# EAGLE design Calliope mini rev0.3.3_gipfel (EAGLE 6.6.0)
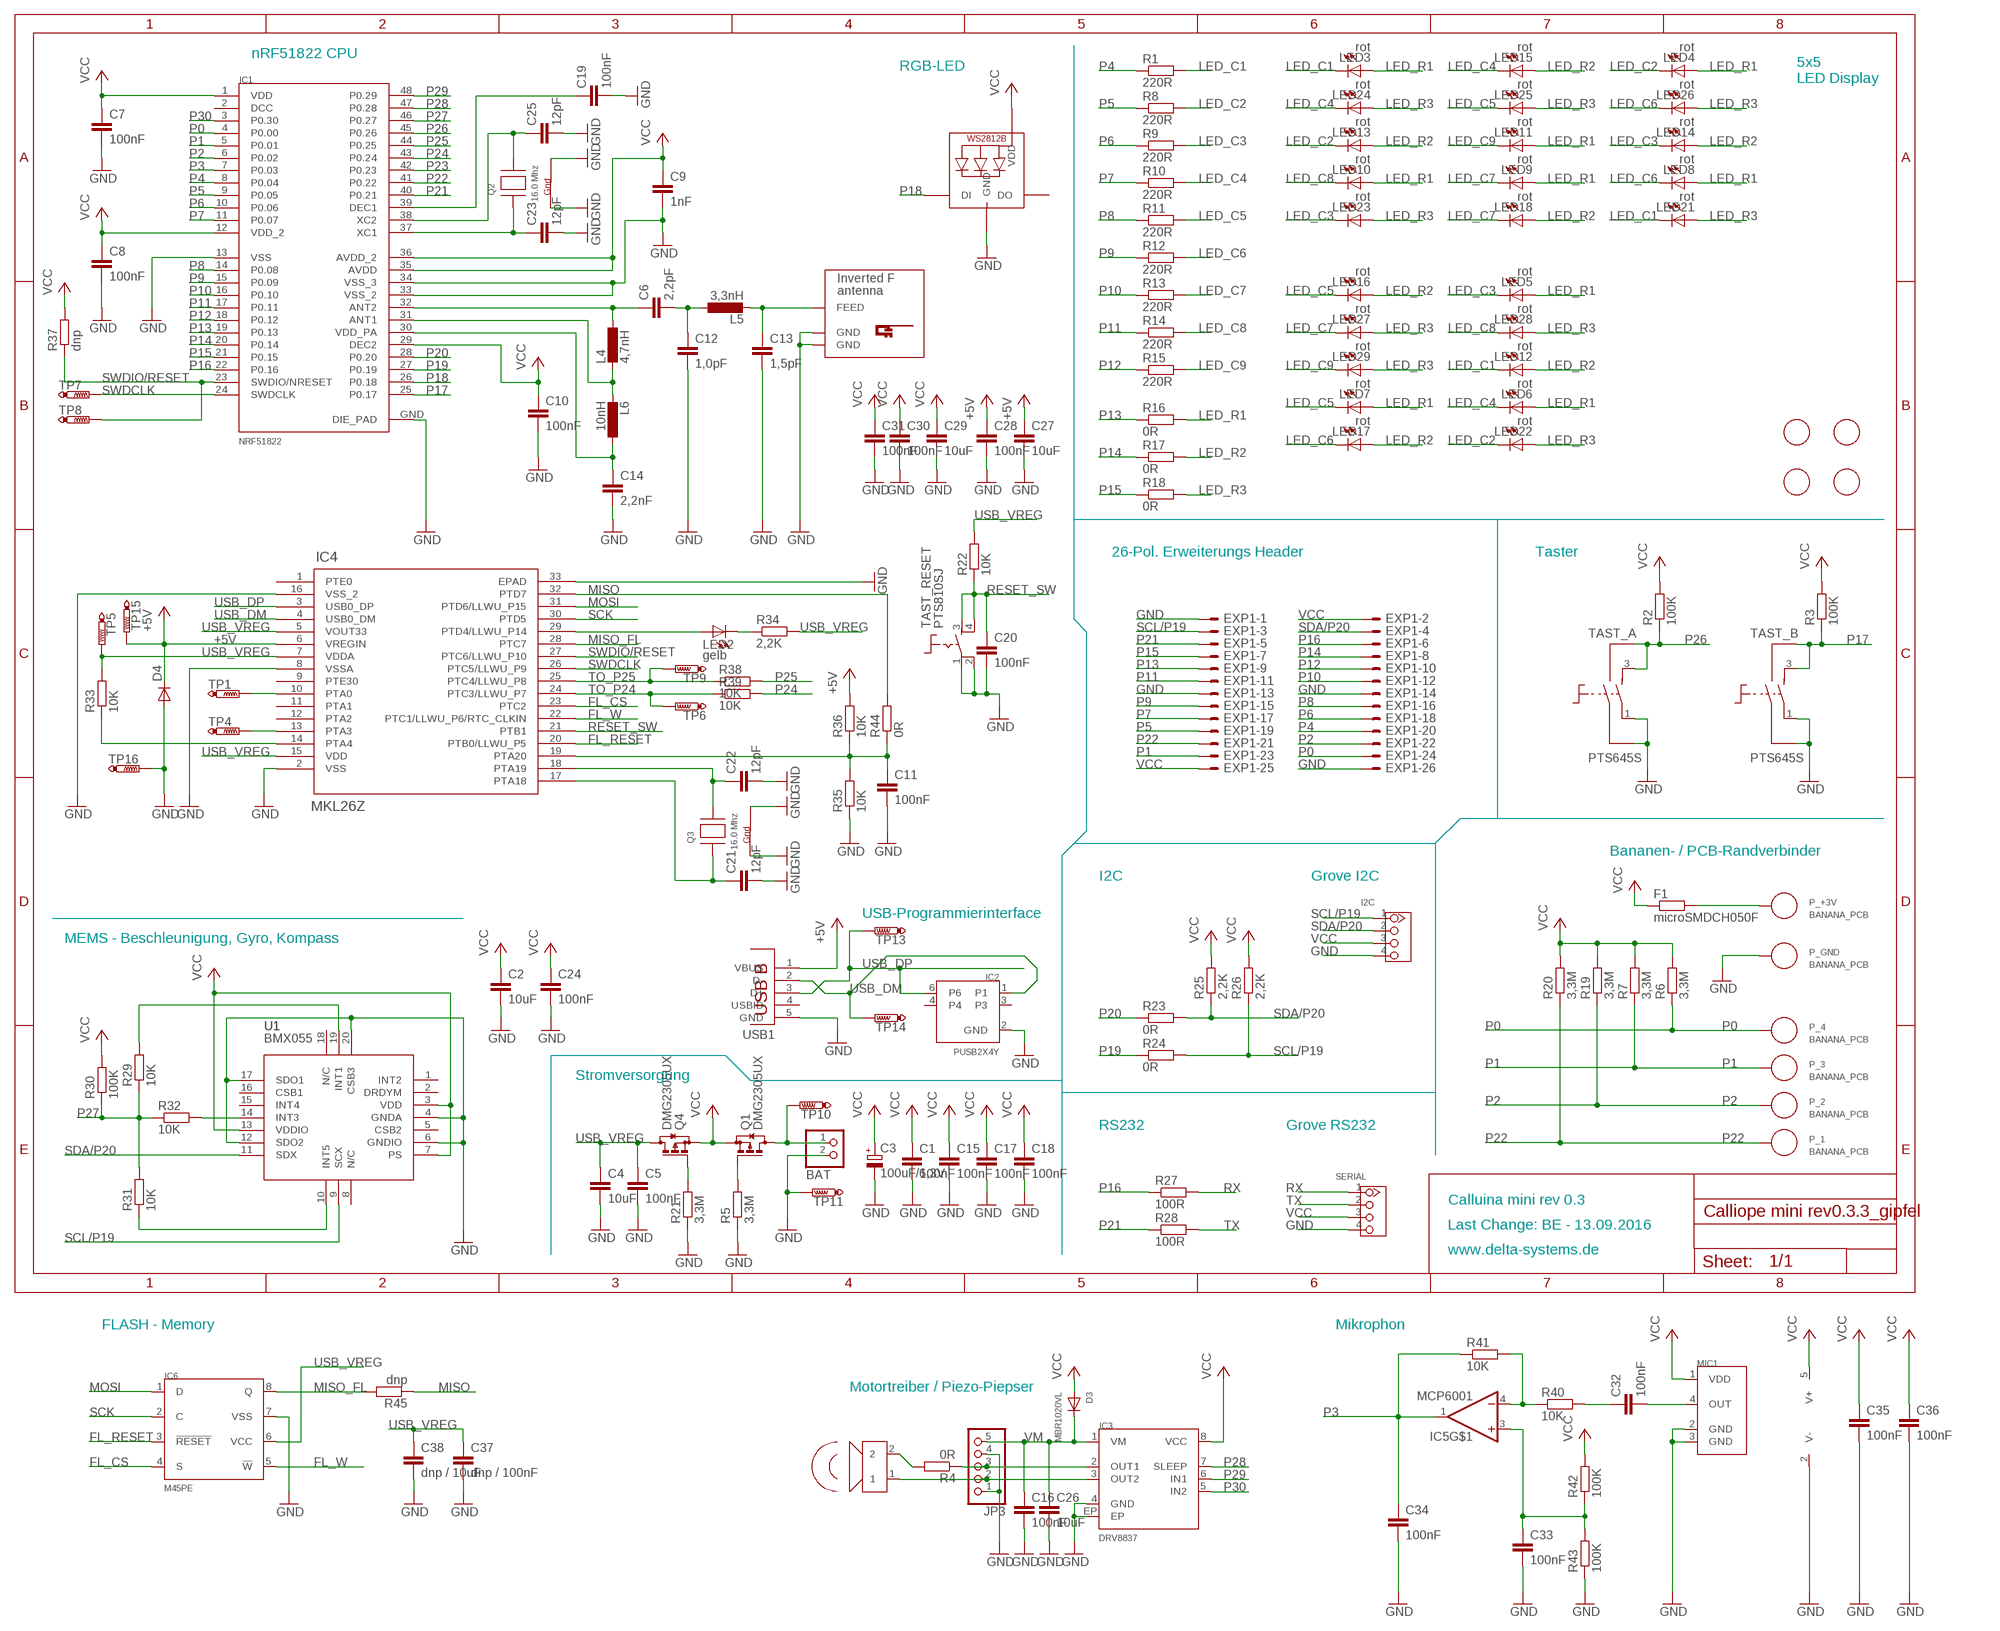
[diagram p0: schematic, sheet 1]

## Parts
BAT  JST_2PIN-SMT-RA  [JST-PH-2-SMT-RA]
C1  100nF  C-EU0402  [0402]
C2  10uF  C-EU0603  [0603]
C3  100uF/6,3V  CPOL-EUD/7343-31R  [D/7343-31R]
C4  10uF  C-EU0603  [0603]
C5  100nF  C-EU0402  [0402]
C6  2,2pF  C-EU0402  [0402]
C7  100nF  C-EU0402  [0402]
C8  100nF  C-EU0402  [0402]
C9  1nF  C-EU0402  [0402]
C10  100nF  C-EU0402  [0402]
C11  100nF  C-EU0402  [0402]
C12  1,0pF  C-EU0402  [0402]
C13  1,5pF  C-EU0402  [0402]
C14  2,2nF  C-EU0402  [0402]
C15  100nF  C-EU0402  [0402]
C16  100nF  C-EU0402  [0402]
C17  100nF  C-EU0402  [0402]
C18  100nF  C-EU0402  [0402]
C19  100nF  C-EU0402  [0402]
C20  100nF  C-EU0402  [0402]
C21  12pF  C-EU0402  [0402]
C22  12pF  C-EU0402  [0402]
C23  12pF  C-EU0402  [0402]
C24  100nF  C-EU0402  [0402]
C25  12pF  C-EU0402  [0402]
C26  10uF  C-EU0603  [0603]
C27  10uF  C-EU0603  [0603]
C28  100nF  C-EU0402  [0402]
C29  10uF  C-EU0603  [0603]
C30  100nF  C-EU0402  [0402]
C31  100nF  C-EU0402  [0402]
C32  100nF  C-EU0402  [0402]
C33  100nF  C-EU0402  [0402]
C34  100nF  C-EU0402  [0402]
C35  100nF  C-EU0402  [0402]
C36  100nF  C-EU0402  [0402]
C37  dnp / 100nF  C-EU0402  [0402]
C38  dnp / 10uF  C-EU0603  [0603]
D3  MBR1020VL  DIODE_SOD-123FL  [SOD-123FL]
D4  DIODE-SOD323-R  [SOD323-R]
EXP1  ML26E  [ML26]
F1  microSMDCH050F  R-EU_R1210  [R1210]
I2C  GROVE-CONNECTOR-DIP(4P-2.0)  [HW4-2.0]
IC1  NRF51822  [QFN48]
IC2  PUSB2X4Y  [SOT363]
IC3  DRV8837  [WSON8]
IC4  MKL26Z  [QFN_32_5X5X0P9]
IC5  MCP6001  OPAMP_SINGLESOT23-5  [SOT23-5]
IC6  M45PE  [VQFN8_6X5]
JP3  PINHD-1X5  [1X05]
L4  4,7nH  L-EU0402  [0402]
L5  3,3nH  L-EU0402  [0402]
L6  10nH  L-EU0402  [0402]
LED1  SK6812MINI  WS2812B3535  [LED3535]
LED2  gelb  LEDCHIPLED_0603  [CHIPLED_0603]
LED3  rot  LEDCHIPLED_0603  [CHIPLED_0603]
LED4  rot  LEDCHIPLED_0603  [CHIPLED_0603]
LED5  rot  LEDCHIPLED_0603  [CHIPLED_0603]
LED6  rot  LEDCHIPLED_0603  [CHIPLED_0603]
LED7  rot  LEDCHIPLED_0603  [CHIPLED_0603]
LED8  rot  LEDCHIPLED_0603  [CHIPLED_0603]
LED9  rot  LEDCHIPLED_0603  [CHIPLED_0603]
LED10  rot  LEDCHIPLED_0603  [CHIPLED_0603]
LED11  rot  LEDCHIPLED_0603  [CHIPLED_0603]
LED12  rot  LEDCHIPLED_0603  [CHIPLED_0603]
LED13  rot  LEDCHIPLED_0603  [CHIPLED_0603]
LED14  rot  LEDCHIPLED_0603  [CHIPLED_0603]
LED15  rot  LEDCHIPLED_0603  [CHIPLED_0603]
LED16  rot  LEDCHIPLED_0603  [CHIPLED_0603]
LED17  rot  LEDCHIPLED_0603  [CHIPLED_0603]
LED18  rot  LEDCHIPLED_0603  [CHIPLED_0603]
LED21  rot  LEDCHIPLED_0603  [CHIPLED_0603]
LED22  rot  LEDCHIPLED_0603  [CHIPLED_0603]
LED23  rot  LEDCHIPLED_0603  [CHIPLED_0603]
LED24  rot  LEDCHIPLED_0603  [CHIPLED_0603]
LED25  rot  LEDCHIPLED_0603  [CHIPLED_0603]
LED26  rot  LEDCHIPLED_0603  [CHIPLED_0603]
LED27  rot  LEDCHIPLED_0603  [CHIPLED_0603]
LED28  rot  LEDCHIPLED_0603  [CHIPLED_0603]
LED29  rot  LEDCHIPLED_0603  [CHIPLED_0603]
MIC1  SPU0410HR5H-PB  [SPU0410HR5H-PB]
P_1  BANANA_PCB  [BANANA_REC]
P_2  BANANA_PCB  [BANANA_REC]
P_3  BANANA_PCB  [BANANA_REC]
P_4  BANANA_PCB  [BANANA_REC]
P_+3V  BANANA_PCB  [BANANA_REC]
P_GND  BANANA_PCB  [BANANA_REC]
Q1  DMG2305UX  BSS84  [SOT23]
Q2  16.0 Mhz  XTAL-4-3225  [NX3225]
Q3  16.0 Mhz  XTAL-4-3225  [NX3225]
Q4  DMG2305UX  BSS84  [SOT23]
R1  220R  R-EU_0402  [0402]
R2  100K  R-EU_0402  [0402]
R3  100K  R-EU_0402  [0402]
R4  0R  R-EU_0402  [0402]
R5  3,3M  R-EU_0402  [0402]
R6  3,3M  R-EU_0402  [0402]
R7  3,3M  R-EU_0402  [0402]
R8  220R  R-EU_0402  [0402]
R9  220R  R-EU_0402  [0402]
R10  220R  R-EU_0402  [0402]
R11  220R  R-EU_0402  [0402]
R12  220R  R-EU_0402  [0402]
R13  220R  R-EU_0402  [0402]
R14  220R  R-EU_0402  [0402]
R15  220R  R-EU_0402  [0402]
R16  0R  R-EU_0402  [0402]
R17  0R  R-EU_0402  [0402]
R18  0R  R-EU_0402  [0402]
R19  3,3M  R-EU_0402  [0402]
R20  3,3M  R-EU_0402  [0402]
R21  3,3M  R-EU_0402  [0402]
R22  10K  R-EU_0402  [0402]
R23  0R  R-EU_0402  [0402]
R24  0R  R-EU_0402  [0402]
R25  2,2K  R-EU_0402  [0402]
R26  2,2K  R-EU_0402  [0402]
R27  100R  R-EU_0402  [0402]
R28  100R  R-EU_0402  [0402]
R29  10K  R-EU_0402  [0402]
R30  100K  R-EU_0402  [0402]
R31  10K  R-EU_0402  [0402]
R32  10K  R-EU_0402  [0402]
R33  10K  R-EU_0402  [0402]
R34  2,2K  R-EU_0402  [0402]
R35  10K  R-EU_0402  [0402]
R36  10K  R-EU_0402  [0402]
R37  dnp  R-EU_0402  [0402]
R38  10K  R-EU_0402  [0402]
R39  10K  R-EU_0402  [0402]
R40  10K  R-EU_0402  [0402]
R41  10K  R-EU_0402  [0402]
R42  100K  R-EU_0402  [0402]
R43  100K  R-EU_0402  [0402]
R44  0R  R-EU_0402  [0402]
R45  dnp  R-EU_0402  [0402]
SERIAL  GROVE-CONNECTOR-DIP(4P-2.0)  [HW4-2.0]
SPK1  PKMCS0909E4000-R1  [PKMCS]
TAST_A  PTS645S  [PTS645S]
TAST_B  PTS645S  [PTS645S]
TAST_RESET  PTS810SJ  [PTS810]
TP1  PTR1B1,27  [B1,27]
TP4  PTR1B1,27  [B1,27]
TP5  PTR1B1,27  [B1,27]
TP6  PTR1B1,27  [B1,27]
TP7  PTR1B1,27  [B1,27]
TP8  PTR1B1,27  [B1,27]
TP9  PTR1B1,27  [B1,27]
TP10  PTR1B1,27  [B1,27]
TP11  PTR1B1,27  [B1,27]
TP13  PTR1B1,27  [B1,27]
TP14  PTR1B1,27  [B1,27]
TP15  PTR1B1,27  [B1,27]
TP16  PTR1B1,27  [B1,27]
U1  BMX055  [BMX055]
U$2  INVERTED_F_ANTENNA  [DN0007+0_MIRROR]
U$5  FIDUCIAL  [FIDUCIAL_1MM]
U$6  FIDUCIAL  [FIDUCIAL_1MM]
U$7  FIDUCIAL  [FIDUCIAL_1MM]
U$8  FIDUCIAL  [FIDUCIAL_1MM]
USB1  USB_47642-0011  [47642-0011]

## Nets
+5V: C27.1 C28.1 D4.C IC4.6(VREGIN) R36.2 TP15.TP USB1.1(VBUS)
BMX_INT5: R31.1 U1.10(INT5)
FL_CS: IC4.23(PTC2) IC6.4(S)
FL_RESET: IC4.20(PTB0/LLWU_P5) IC6.3(!RESET)
FL_W: IC4.22(PTC1/LLWU_P6/RTC_CLKIN) IC6.5(!W)
GND: BAT.2 C1.2 C2.2 C3.- C4.2 C5.2 C7.2 C8.2 C9.2 C10.2 C11.2 C12.2 C13.2 C14.2 C15.2 C16.2 C17.2 C18.2 C19.2 C20.2 C21.2 C22.2 C23.2 C24.2 C25.2 C26.2 C27.2 C28.2 C29.2 C30.2 C31.2 C33.2 C34.2 C35.2 C36.2 C37.2 C38.2 D4.A EXP1.1 EXP1.13 EXP1.14 EXP1.26 I2C.4 IC1.13(VSS) IC1.33(VSS_2) IC1.34(VSS_3) IC1.GND(DIE_PAD) IC2.2(GND) IC3.4(GND) IC3.EP IC4.2(VSS) IC4.8(VSSA) IC4.16(VSS_2) IC4.33(EPAD) IC5.2(V-) IC6.7(VSS) JP3.1 JP3.4 LED1.4(GND) MIC1.2(GND) MIC1.3(GND) P_GND.1 Q2.2(G2) Q2.4(G1) Q3.2(G2) Q3.4(G1) R5.1 R21.1 R35.1 R43.1 SERIAL.4 TAST_A.1 TAST_A.2 TAST_B.1 TAST_B.2 TAST_RESET.1(P) TAST_RESET.2(P1) TP11.TP TP16.TP U1.4(GNDA) U1.6(GNDIO) U1.12(SDO2) U1.17(SDO1) U1.20(CSB3) U$2.GND U$2.GND@1(GND) USB1.5(GND)
LED_C1: LED3.A LED12.A LED21.A R1.2
LED_C2: LED4.A LED13.A LED22.A R8.2
LED_C3: LED5.A LED14.A LED23.A R9.2
LED_C4: LED6.A LED15.A LED24.A R10.2
LED_C5: LED7.A LED16.A LED25.A R11.2
LED_C6: LED8.A LED17.A LED26.A R12.2
LED_C7: LED9.A LED18.A LED27.A R13.2
LED_C8: LED10.A LED28.A R14.2
LED_C9: LED11.A LED29.A R15.2
LED_R1: LED3.C LED4.C LED5.C LED6.C LED7.C LED8.C LED9.C LED10.C LED11.C R16.2
LED_R2: LED12.C LED13.C LED14.C LED15.C LED16.C LED17.C LED18.C R17.2
LED_R3: LED21.C LED22.C LED23.C LED24.C LED25.C LED26.C LED27.C LED28.C LED29.C R18.2
MISO: IC4.32(PTD7) R44.2 R45.1
MISO_FL: IC4.28(PTC7) IC6.8(Q) R45.2
MOSI: IC4.31(PTD6/LLWU_P15) IC6.1(D)
N$1: IC3.3(OUT2) JP3.2 SPK1.1
N$2: C25.1 IC1.38(XC2) Q2.3(X2)
N$3: R29.2 U1.19(INT1)
N$4: IC4.14(PTA4) R33.1
N$5: IC4.29(PTD4/LLWU_P14) LED2.C
N$6: R32.2 U1.14(INT3)
N$7: Q1.1(G) R5.2
N$8: LED2.A R34.1
N$9: F1.2 P_+3V.1
N$10: IC3.2(OUT1) JP3.3 R4.1
N$11: C22.1 IC4.18(PTA19) Q3.3(X2)
N$12: R4.2 SPK1.2
N$13: C23.1 IC1.37(XC1) Q2.1(X1)
N$14: C14.1 IC1.30(VDD_PA) L6.1
N$15: C6.1 IC1.32(ANT2) L4.1
N$16: C6.2 C12.1 L5.1
N$17: C13.1 L5.2 U$2.FEED
N$18: IC1.31(ANT1) L4.2 L6.2
N$19: C19.1 IC1.39(DEC1)
N$20: C21.1 IC4.17(PTA18) Q3.1(X1)
N$21: Q4.1(G) R21.2
N$24: C33.1 IC5.3(+IN) R42.1 R43.2
N$27: C11.1 IC4.19(PTA20) R35.2 R36.1 R44.1
N$29: IC5.4(-IN) R40.1 R41.2
N$30: C32.1 R40.2
N$31: C32.2 MIC1.4(OUT)
P0: EXP1.24 IC1.4(P0.00) P_4.1 R6.1
P1: EXP1.23 IC1.5(P0.01) P_3.1 R7.1
P2: EXP1.22 IC1.6(P0.02) P_2.1 R19.1
P3: C34.1 IC1.7(P0.03) IC5.1(OUT) R41.1
P4: EXP1.20 IC1.8(P0.04) R1.1
P5: EXP1.19 IC1.9(P0.05) R8.1
P6: EXP1.18 IC1.10(P0.06) R9.1
P7: EXP1.17 IC1.11(P0.07) R10.1
P8: EXP1.16 IC1.14(P0.08) R11.1
P9: EXP1.15 IC1.15(P0.09) R12.1
P10: EXP1.12 IC1.16(P0.10) R13.1
P11: EXP1.11 IC1.17(P0.11) R14.1
P12: EXP1.10 IC1.18(P0.12) R15.1
P13: EXP1.9 IC1.19(P0.13) R16.1
P14: EXP1.8 IC1.20(P0.14) R17.1
P15: EXP1.7 IC1.21(P0.15) R18.1
P16: EXP1.6 IC1.22(P0.16) R27.1
P17: IC1.25(P0.17) R3.1 TAST_B.3(S1) TAST_B.4(S2)
P18: IC1.26(P0.18) LED1.1(DI)
P19: IC1.27(P0.19) R24.1
P20: IC1.28(P0.20) R23.1
P21: EXP1.5 IC1.40(P0.21) R28.1
P22: EXP1.21 IC1.41(P0.22) P_1.1 R20.1
P23: IC1.42(P0.23)
P24: IC1.43(P0.24) R39.2
P25: IC1.44(P0.25) R38.2
P26: IC1.45(P0.26) R2.1 TAST_A.3(S1) TAST_A.4(S2)
P27: IC1.46(P0.27) R29.1 R30.1 R31.2 R32.1
P28: IC1.47(P0.28) IC3.7(SLEEP)
P29: IC1.48(P0.29) IC3.6(IN1)
P30: IC1.3(P0.30) IC3.5(IN2)
RESET_SW: C20.1 IC4.21(PTB1) R22.1 TAST_RESET.3(S) TAST_RESET.4(S1)
RX: R27.2 SERIAL.1
SCK: IC4.30(PTD5) IC6.2(C)
SCL/P19: EXP1.3 I2C.1 R24.2 R26.1 U1.9(SCX)
SDA/P20: EXP1.4 I2C.2 R23.2 R25.1 U1.11(SDX)
SWCLK: IC4.10(PTA0) TP1.TP
SWDCLK: IC1.24(SWDCLK) IC4.26(PTC5/LLWU_P9) TP7.TP
SWDIO: IC4.13(PTA3) TP4.TP
SWDIO/RESET: IC1.23(SWDIO/NRESET) IC4.27(PTC6/LLWU_P10) R37.1 TP8.TP
TO_P24: IC4.24(PTC3/LLWU_P7) R39.1 TP6.TP
TO_P25: IC4.25(PTC4/LLWU_P8) R38.1 TP9.TP
TX: R28.2 SERIAL.2
USB_DM: IC2.1 IC4.4(USB0_DM) TP14.TP USB1.2(D-)
USB_DP: IC2.6 IC4.3(USB0_DP) TP13.TP USB1.3(D+)
USB_VREG: C4.1 C5.1 C37.1 C38.1 IC4.5(VOUT33) IC4.7(VDDA) IC4.15(VDD) IC6.6(VCC) Q4.3(D) R22.2 R33.2 R34.2 TP5.TP
VCC: C1.1 C2.1 C3.+ C7.1 C8.1 C9.1 C10.1 C15.1 C17.1 C18.1 C24.1 C29.1 C30.1 C31.1 C35.1 C36.1 D3.A EXP1.2 EXP1.25 F1.1 I2C.3 IC1.1(VDD) IC1.12(VDD_2) IC1.29(DEC2) IC1.35(AVDD) IC1.36(AVDD_2) IC3.8(VCC) IC5.5(V+) LED1.2(VDD) MIC1.1(VDD) Q1.2(S) Q4.2(S) R2.2 R3.2 R6.2 R7.2 R19.2 R20.2 R25.2 R26.2 R30.2 R37.2 R42.2 SERIAL.3 U1.3(VDD) U1.7(PS) U1.13(VDDIO)
VIN: BAT.1 Q1.3(D) TP10.TP
VM: C16.1 C26.1 D3.C IC3.1(VM) JP3.5
Unconnected: IC1.2(DCC) IC2.3 IC2.4 IC4.1(PTE0) IC4.9(PTE30) IC4.11(PTA1) IC4.12(PTA2) LED1.3(DO) U1.1(INT2) U1.2(DRDYM) U1.5(CSB2) U1.8(N/C) U1.15(INT4) U1.16(CSB1) U1.18(N/C) USB1.4(USBID)

## Notes on the sheet
- nRF51822 CPU
- RGB-LED
- 5x5
  LED Display
- 26-Pol. Erweiterungs Header | Taster
- Bananen- / PCB-Randverbinder
- I2C | Grove I2C
- USB-Programmierinterface
- MEMS - Beschleunigung, Gyro, Kompass
- Stromversorgung
- RS232 | Grove RS232
- Calluina mini rev 0.3
- Last Change: BE - 13.09.2016
- www.delta-systems.de
- FLASH - Memory | Mikrophon
- Motortreiber / Piezo-Piepser

## Library data of the parts
BAT = adafruit:JST_2PIN: JST 2-Pin Connectors of various flavors SMT-RA (S2B-PH-SM4) 4UConnector #17311 SMT (B2B-PH-SM4) THM-RA (S2B-PH) THM (B2B-PH)
C1 C2 C4-C38 = rcl:C-EU: CAPACITOR, European symbol
C3 = resistor:CPOL-EU: POLARIZED CAPACITOR, European symbol
D3 = adafruit:DIODE: Diode SMADIODE - SMA Surface Mount Package 20V 1A Schottky Diode Digikey: 641-1014-6-ND DO-1N4148 - Through Hole Small Current Diode SOD-123 20V 1 A (.5mV Vf) Schottky Diode - Digikey: MBRX120TPMSCT-ND SOD-323 10V 570mA (.38mV Vf, 3ns) Schottky Diode - Digikey: ZLLS410CT-ND SOD-523 30V 30mA Schottky Diode (RB751S-40TE61) - Digikey: RB751S-40TE61CT-ND SOT23-R/W - SOT23 Package (R = Solder Paste/Reflow Ovens, W = Hand-Soldering) BAT54Film 40V 300mA - Digikey: 497-7162-1-ND
D4 = diode:DIODE-: DIODE
EXP1 = con-harting-ml:ML26?E: HARTING; OC_FARNELL: unknown; OC_NEWARK: unknown
F1 R1-R45 = rcl:R-EU_: RESISTOR, European symbol
I2C SERIAL = Seeed-OPL-Connector:GROVE-CONNECTOR-DIP(4P-2.0): 320110033; VALUE: 4P-2.0
IC1 = NordicSemi:NRF51822: Bluetooth 4.0 Low Energy/2.4Ghz NORDIC SEMICONDUCTOR
IC2 = Bjorn4:PUSB2X4Y
IC3 = Bjorn4:DRV8837
IC4 = nxp-mkl26z:MKL26Z
IC5 = Bjorn4:OPAMP_SINGLE
IC6 = Bjorn4:M45PE
JP3 = pinhead_bjorn:PINHD-1X5: PIN HEADER
L4-L6 = rcl:L-EU: INDUCTOR, European symbol
LED1 = adafruit:WS2812B
LED2-LED18 LED21-LED29 = led:LED: LED OSRAM: - CHIPLED LG R971, LG N971, LY N971, LG Q971, LY Q971, LO R971, LY R971 LH N974, LH R974 LS Q976, LO Q976, LY Q976 LO Q996 - Hyper CHIPLED LW Q18S LB Q993, LB Q99A, LB R99A - SideLED LS A670, LO A670, LY A670, LG A670, LP A670 LB A673, LV A673, LT A673, LW A673 LH A674 LY A675 LS A676, LA A676, LO A676, LY A676, LW A676 LS A679, LY A679, LG A679 - Hyper Micro SIDELED® LS Y876, LA Y876, LO Y876, LY Y876 LT Y87S - SmartLED LW L88C, LW L88S LB L89C, LB L89S, LG L890 LS L89K, LO L89K, LY L89K LS L896, LA L896, LO L896, LY L896 - TOPLED LS T670, LO T670, LY T670, LG T670, LP T670 LSG T670, LSP T670, LSY T670, LOP T670, LYG T670 LG T671, LOG T671, LSG T671 LB T673, LV T673, LT T673, LW T673 LH T674 LS T676, LA T676, LO T676, LY T676, LB T676, LH T676, LSB T676, LW T676 LB T67C, LV T67C, LT T67C, LS T67K, LO T67K, LY T67K, LW E67C LS E67B, LA E67B, LO E67B, LY E67B, LB E67C, LV E67C, LT E67C LW T67C LS T679, LY T679, LG T679 LS T770, LO T770, LY T770, LG T770, LP T770 LB T773, LV T773, LT T773, LW T773 LH T774 LS E675, LA E675, LY E675, LS T675 LS T776, LA T776, LO T776, LY T776, LB T776 LHGB T686 LT T68C, LB T68C - Hyper Mini TOPLED® LB M676 - Mini TOPLED Santana® LG M470 LS M47K, LO M47K, LY M47K Source: http://www.osram.convergy.de LUXEON: - LUMILED® LXK2-PW12-R00, LXK2-PW12-S00, LXK2-PW14-U00, LXK2-PW14-V00 LXK2-PM12-R00, LXK2-PM12-S00, LXK2-PM14-U00 LXK2-PE12-Q00, LXK2-PE12-R00, LXK2-PE12-S00, LXK2-PE14-T00, LXK2-PE14-U00 LXK2-PB12-K00, LXK2-PB12-L00, LXK2-PB12-M00, LXK2-PB14-N00, LXK2-PB14-P00, LXK2-PB14-Q00 LXK2-PR12-L00, LXK2-PR12-M00, LXK2-PR14-Q00, LXK2-PR14-R00 LXK2-PD12-Q00, LXK2-PD12-R00, LXK2-PD12-S00 LXK2-PH12-R00, LXK2-PH12-S00 LXK2-PL12-P00, LXK2-PL12-Q00, LXK2-PL12-R00 Source: www.luxeon.com KINGBRIGHT: KA-3528ASYC Source: www.kingbright.com
MIC1 = Bjorn4:SPU0410HR5H-PB
P_1-P_4 P_+3V P_GND = Bjorn4:BANANA_PCB
Q1 Q4 = transistor-small-signal:BSS84: P-CHANNEL MOS FET
Q2 Q3 = adafruit:XTAL-4: Classic 4-pin 3.2 x 2.5mm crystal
SPK1 = Bjorn4:PKMCS
TAST_A TAST_B = Bjorn4:PTS645
TAST_RESET = Bjorn4:PTS810
TP1 TP4-TP11 TP13-TP16 = testpad:PTR1: TEST PIN
U1 = x-io:BMX055
U$2 = antenna:INVERTED_F_ANTENNA: 2.4GHz Inverted F Antenna Based on TI Design Note DN007
U$5-U$8 = adafruit:FIDUCIAL: For use by pick and place machines to calibrate the vision/machine, 1mm By microbuilder.eu
USB1 = Bjorn4:USB_47642-0011

## Board
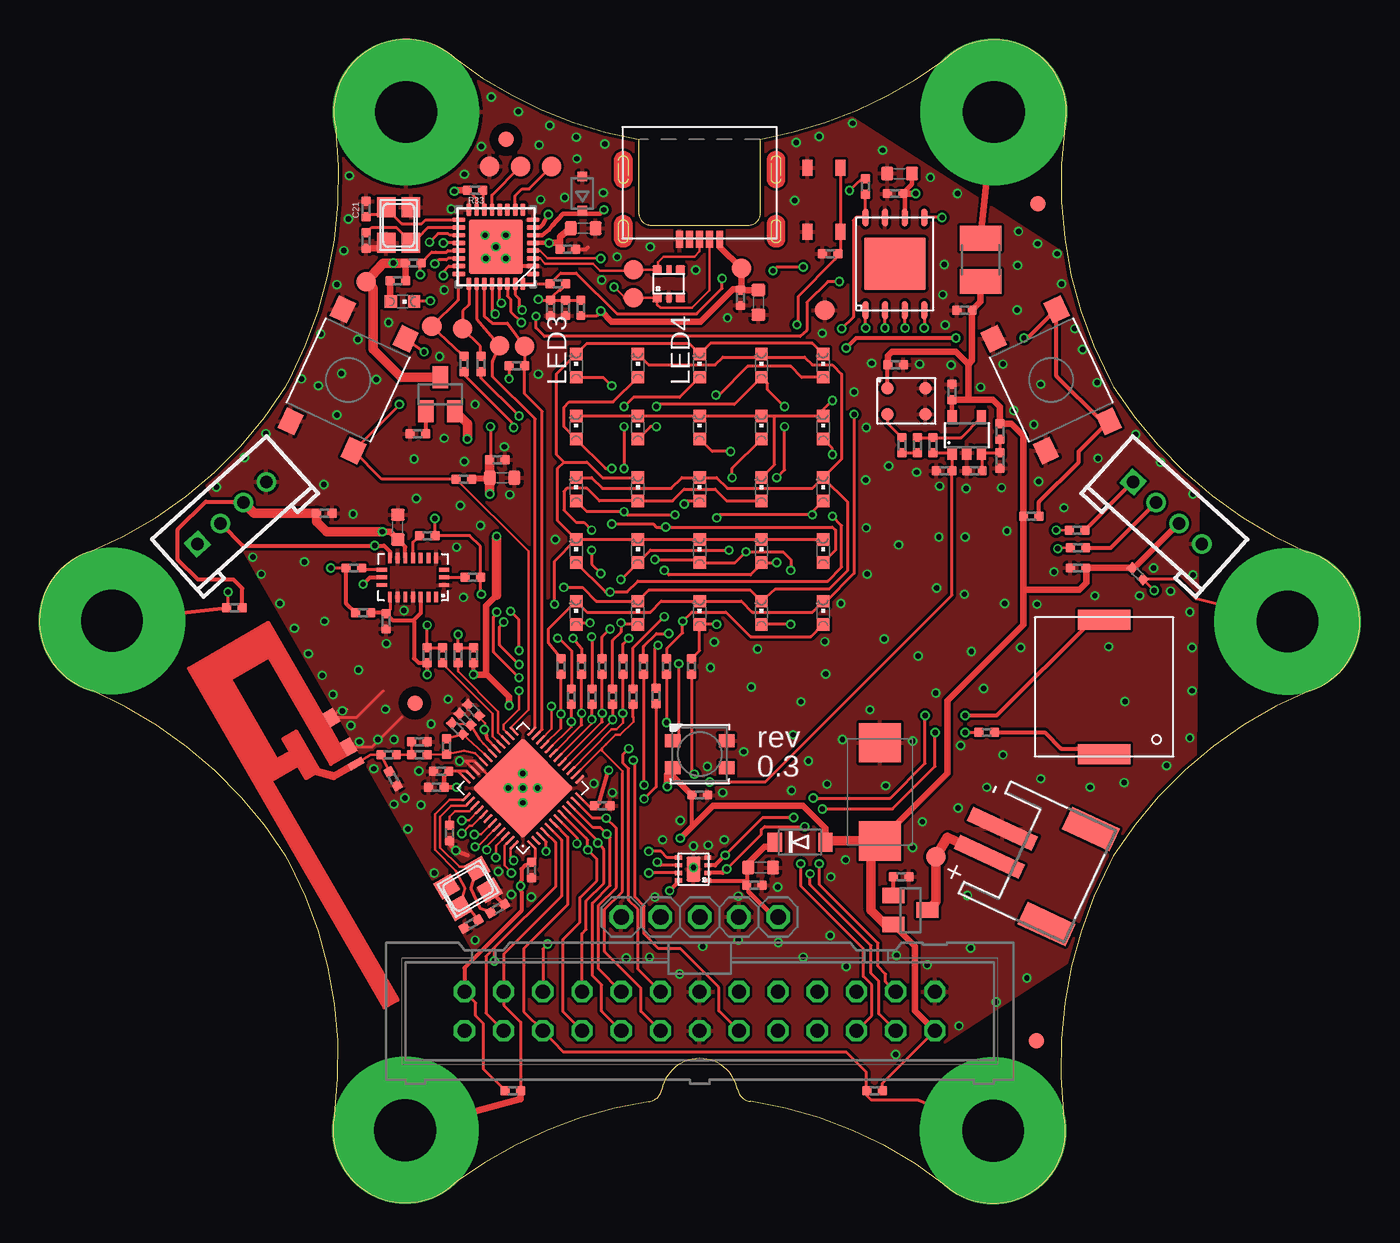
[diagram p1: board, top side]
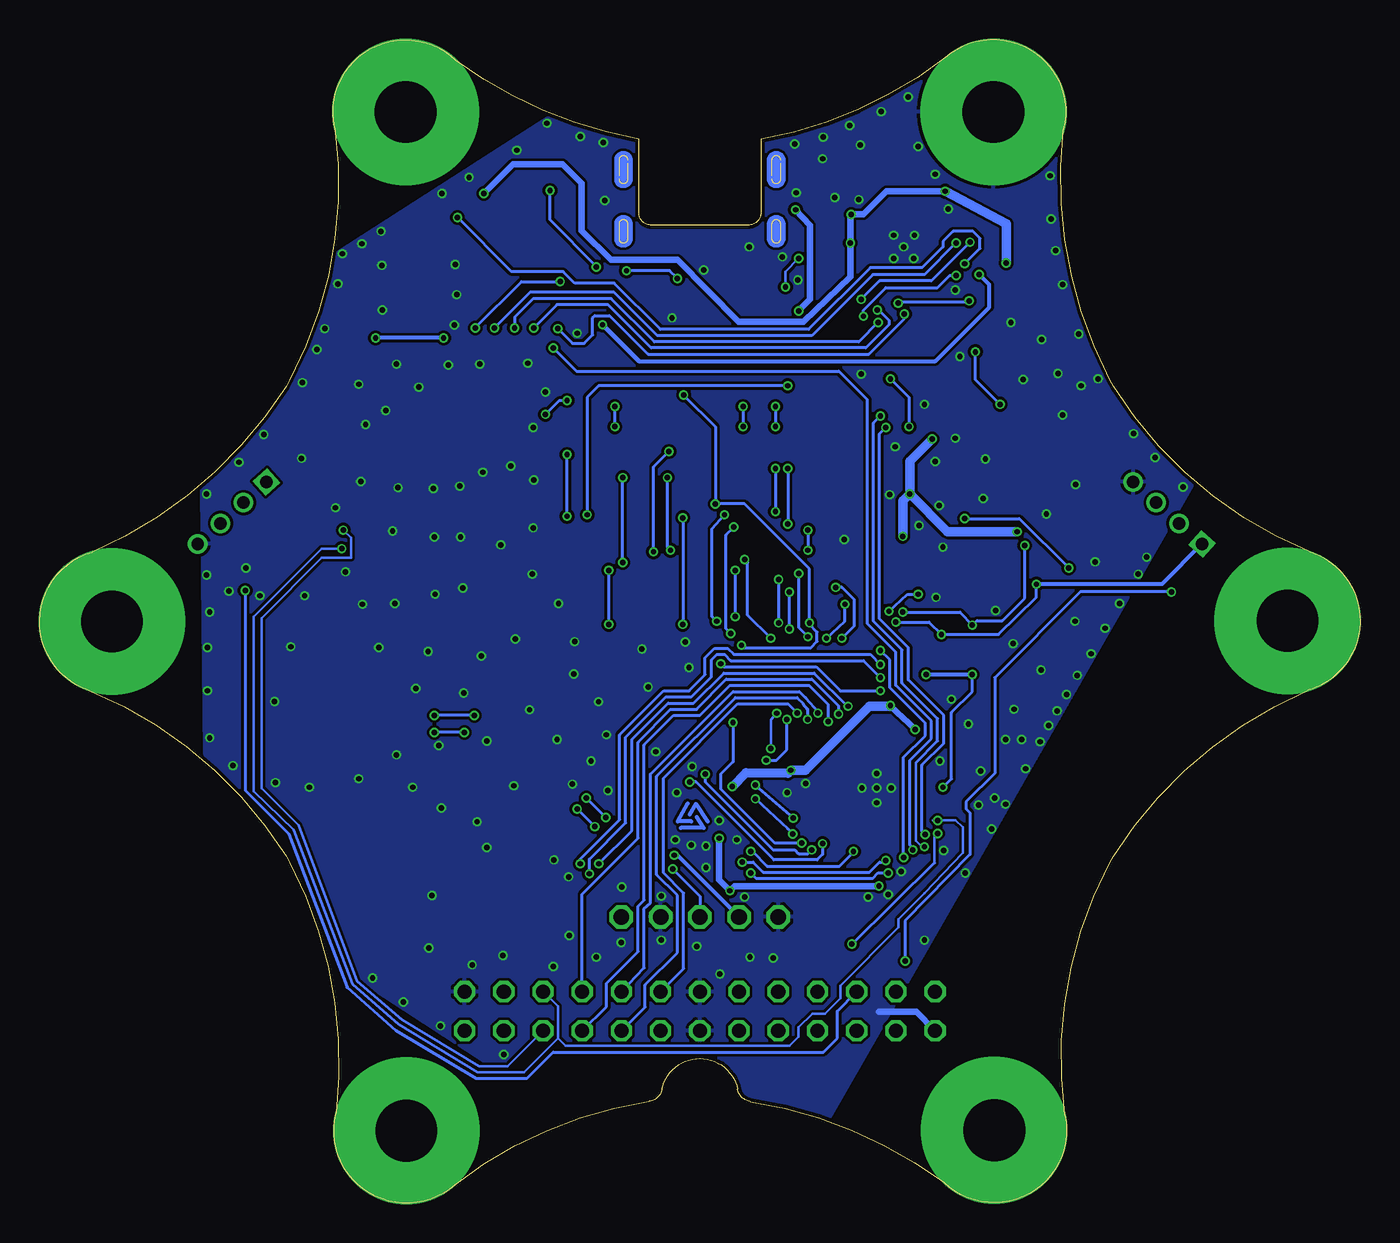
[diagram p2: board, bottom side, seen from below]

Size 85.54 x 75.36 mm. Coordinates in mm from the lower left corner, seen from the top.
Outline: 38.82,68.89 arc-28 26.9,74.16 arc146 19.21,69.54 arc-34 16.21,53.31 15.96,52.87 arc-36 3.25,42.18 arc146 3.4,33.2 arc-34 15.96,22.5 16.21,22.05 arc-36 19.11,5.7 arc146 26.96,1.35 arc-28 39.49,6.57 arc70 40.32,7.36 arc-157 45.22,7.37 arc70 46.05,6.59 arc-29 58.64,1.2 arc146 66.33,5.83 arc-34 69.33,22.05 69.58,22.5 arc-36 82.3,33.18 arc146 82.14,42.16 arc-34 69.58,52.87 69.33,53.31 arc-36 66.43,69.66 arc146 58.58,74.01 arc-26 46.72,68.9 46.72,68.88
Outline: 38.82,68.88 38.82,68.89
Copper layers (1*16): Top 0.035mm / dielectric 1.55mm / Bottom 0.035mm
Design rules "eC_2Layer_PClass6_BaseCopperO35 *": minimum track width 0.15mm, minimum drill 0.35mm, track to track 0.175mm, track to pad 0.175mm, pad to pad 0.175mm, via to via 0.175mm, smd to smd 0mil, copper to edge 0.25mm, drill to drill 0.35mm, minimum pad ring 0.175mm, minimum via ring 0.125mm, stop-mask expansion 0mil, vias tented up to drill 0.45mm, thermal gap 0.2mm
tRestrict: 4 lines

### Footprints (pad centres in the part's own frame; a part is rotated, then mirrored left to right if it is on the bottom)
JST-PH-2-SMT-RA = smd 1 x 4.6: 1 1,-3.7; 2 -1,-3.7 | smd 1.6 x 3.4: NC1 -3.4,1.5; NC2 3.4,1.5
0402 = smd 0.6 x 0.6: 1 -0.5,0; 2 0.5,0
0603 = smd 0.8 x 0.9: 1 -0.8,0; 2 0.8,0
D/7343-31R = smd 2.55 x 2.7: + 3.175,0; - -3.175,0
SOD-123FL = smd 0.91 x 1.22: A 1.637,0; C -1.637,0
SOD323-R = smd 0.6 x 0.6: A 1.1,0; C -1.1,0
ML26 = drill 0.914 octagon: 1 -15.24,-1.27; 2 -15.24,1.27; 3 -12.7,-1.27; 4 -12.7,1.27; 5 -10.16,-1.27; 6 -10.16,1.27; 7 -7.62,-1.27; 8 -7.62,1.27; 9 -5.08,-1.27; 10 -5.08,1.27; 11 -2.54,-1.27; 12 -2.54,1.27; 13 0,-1.27; 14 0,1.27; 15 2.54,-1.27; 16 2.54,1.27; 17 5.08,-1.27; 18 5.08,1.27; 19 7.62,-1.27; 20 7.62,1.27; 21 10.16,-1.27; 22 10.16,1.27; 23 12.7,-1.27; 24 12.7,1.27; 25 15.24,-1.27; 26 15.24,1.27
R1210 = smd 1.6 x 2.7: 1 -1.4,0; 2 1.4,0
HW4-2.0 = drill 0.8 pad 1.27 square: 1 -3,0 | drill 0.8 pad 1.27: 2 -1,0; 3 1,0; 4 3,0
QFN48 = smd 0.8 x 0.2: 1 -3,2.2; 2 -3,1.8; 3 -3,1.4; 4 -3,1; 5 -3,0.6; 6 -3,0.2; 7 -3,-0.2; 8 -3,-0.6; 9 -3,-1; 10 -3,-1.4; 11 -3,-1.8; 12 -3,-2.2; 25 3,-2.2; 26 3,-1.8; 27 3,-1.4; 28 3,-1; 29 3,-0.6; 30 3,-0.2; 31 3,0.2; 32 3,0.6; 33 3,1; 34 3,1.4; 35 3,1.8; 36 3,2.2 | smd 0.2 x 0.8: 13 -2.2,-3; 14 -1.8,-3; 15 -1.4,-3; 16 -1,-3; 17 -0.6,-3; 18 -0.2,-3; 19 0.2,-3; 20 0.6,-3; 21 1,-3; 22 1.4,-3; 23 1.8,-3; 24 2.2,-3; 37 2.2,3; 38 1.8,3; 39 1.4,3; 40 1,3; 41 0.6,3; 42 0.2,3; 43 -0.2,3; 44 -0.6,3; 45 -1,3; 46 -1.4,3; 47 -1.8,3; 48 -2.2,3 | smd 4.65 x 4.65: GND 0,0
SOT363 = smd 0.6 x 0.6: 1 -0.9,0.75; 3 -0.9,-0.75; 4 0.9,-0.75; 6 0.9,0.75 | smd 0.6 x 0.4: 2 -0.9,0; 5 0.9,0
WSON8 = smd 0.28 x 0.5: 1 -0.75,-0.925; 2 -0.25,-0.925; 3 0.25,-0.925; 4 0.75,-0.925; 5 0.75,0.975; 6 0.25,0.975; 7 -0.25,0.975; 8 -0.75,0.975 | smd 1.6 x 0.9: EP 0,0
QFN_32_5X5X0P9 = smd 0.813 x 0.305: 1 -2.402,1.75; 2 -2.402,1.25; 3 -2.402,0.75; 4 -2.402,0.25; 5 -2.402,-0.25; 6 -2.402,-0.75; 7 -2.402,-1.25; 8 -2.402,-1.75; 17 2.402,-1.75; 18 2.402,-1.25; 19 2.402,-0.75; 20 2.402,-0.25; 21 2.402,0.25; 22 2.402,0.75; 23 2.402,1.25; 24 2.402,1.75 | smd 0.305 x 0.813: 9 -1.75,-2.402; 10 -1.25,-2.402; 11 -0.75,-2.402; 12 -0.25,-2.402; 13 0.25,-2.402; 14 0.75,-2.402; 15 1.25,-2.402; 16 1.75,-2.402; 25 1.75,2.402; 26 1.25,2.402; 27 0.75,2.402; 28 0.25,2.402; 29 -0.25,2.402; 30 -0.75,2.402; 31 -1.25,2.402; 32 -1.75,2.402 | smd 3.5 x 3.5: 33 0,0
SOT23-5 = smd 0.6 x 0.9: 1 -0.95,-1.15; 2 0,-1.15; 3 0.95,-1.15; 4 0.95,1.15; 5 -0.95,1.15
VQFN8_6X5 = smd 1.2 x 0.4: 1 -3,1.905; 2 -3,0.635; 3 -3,-0.635; 4 -3,-1.905; 5 3,-1.905; 6 3,-0.635; 7 3,0.635; 8 3,1.905 | smd 3.4 x 4: EP 0,0
1X05 = drill 1.016 octagon: 1 -5.08,0; 2 -2.54,0; 3 0,0; 4 2.54,0; 5 5.08,0
LED3535 = smd 1 x 0.85: 1 -1.75,0.875; 2 -1.75,-0.875; 3 1.75,-0.875; 4 1.75,0.875
CHIPLED_0603 = smd 0.8 x 0.8: A 0,-0.75; C 0,0.75
SPU0410HR5H-PB = smd 0.8 x 0.8: 1 0.85,1.23; 2 0.85,-1.23; 3 -0.85,-1.23; 4 -0.85,1.23
BANANA_REC = drill 4 pad 9.5: 1 0,0
SOT23 = smd 1 x 1.4: 1 -0.95,-1.1; 2 0.95,-1.1; 3 0,1.1
NX3225 = smd 1.3 x 1.2: 1 -1.15,-0.8; 2 1.15,-0.8; 3 1.15,0.8; 4 -1.15,0.8
PKMCS = smd 1.3 x 3.4: 1 -4.35,0; 2 4.35,0
PTS645S = smd 1.45 x 1.2: 1 -4,2.25; 2 4,2.25; 3 -4,-2.25; 4 4,-2.25
PTS810 = smd 1.05 x 0.65: 1 -2.075,1.075; 2 2.075,1.075; 3 -2.075,-1.075; 4 2.075,-1.075
B1,27 = smd 1.27 x 1.27: TP 0,0
BMX055 = smd 0.675 x 0.25: 1 1.262,1.5; 2 1.262,1; 3 1.262,0.5; 4 1.262,0; 5 1.262,-0.5; 6 1.262,-1; 7 1.262,-1.5; 11 -1.262,-1.5; 12 -1.262,-1; 13 -1.262,-0.5; 14 -1.262,0; 15 -1.262,0.5; 16 -1.262,1; 17 -1.262,1.5 | smd 0.25 x 0.675: 8 0.5,-2.013; 9 0,-2.013; 10 -0.5,-2.013; 18 -0.5,2.013; 19 0,2.013; 20 0.5,2.013
DN0007+0_MIRROR = smd 0.46 x 1 bottom: FEED 2.22,-2.8 | smd 1.01 x 0.74 bottom: GND -1.16,-2.93; GND@1 1.035,-2.93
FIDUCIAL_1MM = smd 1 x 1: 1 0,0
47642-0011 = smd 0.45 x 1.1: 1 -1.3,6.47; 2 -0.65,6.47; 3 0,6.47; 4 0.65,6.47; 5 1.3,6.47

### Placement (x,y rotation side)
BAT  65.32,21.78 245 top
C1  42.77,26.43 0 top
C2  23.22,43.78 90 top
C3  54.45,26.64 270 top
C4  35.22,63.13 0 top
C5  34.22,61.78 0 top
C6  24.62,29.03 180 top
C7  31.87,21.58 270 top
C8  36.47,25.73 0 top
C9  26.02,27.98 180 top
C10  28.12,31.93 135 top
C11  33.12,57.98 270 top
C12  24.62,29.88 0 top
C13  22.92,27.48 300 top
C14  27.57,31.33 135 top
C15  25.72,26.93 180 top
C16  46.32,20.58 0 top
C17  18.47,44.68 0 top
C18  67.27,41.13 180 top
C19  26.57,23.98 270 top
C20  51.22,61.48 180 top
C21  21.17,64.38 90 top
C22  21.17,62.33 270 top
C23  27.97,18.08 210 top
C24  22.47,37.68 270 top
C25  29.67,19.08 30 top
C26  46.72,21.73 0 top
C27  46.57,58.33 270 top
C28  45.42,58.63 270 top
C29  29.97,46.98 0 top
C30  29.67,48.13 0 top
C31  59.92,57.83 180 top
C32  55.87,49.08 90 top
C33  60.57,47.43 180 top
C34  58.62,47.43 180 top
C35  55.47,54.28 0 top
C36  59.12,52.53 90 top
C37  55.42,65.38 180 top
C38  55.72,66.68 180 top
D3  49.27,23.38 0 top
D4  35.17,65.38 90 top
EXP1  42.77,12.43 180 top
F1  60.97,61.08 90 top
I2C  12.47,44.69 42 top
IC1  31.32,26.88 135 top
IC2  40.77,59.53 90 top
IC3  42.37,21.63 90 top
IC4  29.57,61.93 180 top
IC5  60.07,49.73 0 top
IC6  55.42,60.83 90 top
JP3  42.77,18.53 0 top
L4  26.37,29.58 90 top
L5  22.62,29.03 180 top
L6  27.07,30.73 315 top
LED1  42.77,29.08 0 top
LED2  23.52,58.38 270 top
LED3  34.77,54.23 0 top
LED4  42.77,54.23 0 top
LED5  50.77,54.23 0 top
LED6  50.77,42.23 0 top
LED7  46.77,42.23 0 top
LED8  42.77,42.23 0 top
LED9  38.77,42.23 0 top
LED10  34.77,42.23 0 top
LED11  38.77,46.23 0 top
LED12  50.77,46.23 0 top
LED13  34.77,46.23 0 top
LED14  42.77,46.23 0 top
LED15  38.77,54.23 0 top
LED16  46.77,54.23 0 top
LED17  46.77,38.23 0 top
LED18  38.77,38.23 0 top
LED21  42.77,38.23 0 top
LED22  50.77,38.23 0 top
LED23  34.77,38.23 0 top
LED24  34.77,50.23 0 top
LED25  38.77,50.23 0 top
LED26  42.77,50.23 0 top
LED27  46.77,50.23 0 top
LED28  50.77,50.23 0 top
LED29  46.77,46.23 0 top
MIC1  56.17,51.93 90 top
P_1  80.86,37.66 0 top
P_2  61.78,4.69 0 top
P_3  23.7,4.72 0 top
P_4  4.7,37.71 0 top
P_+3V  61.84,70.65 0 top
P_GND  23.75,70.66 0 top
Q1  56.42,18.98 270 top
Q2  27.77,20.38 30 top
Q3  23.27,63.33 270 top
Q4  25.97,52.38 0 top
R1  42.24,34.74 90 top
R2  64.26,44.49 180 top
R3  27.48,46.89 0 top
R4  61.37,30.48 0 top
R5  55.82,21.13 180 top
R6  12.64,38.56 0 top
R7  30.66,7.28 180 top
R8  40.62,34.74 90 top
R9  39.95,32.84 90 top
R10  39.13,34.74 90 top
R11  38.46,32.79 90 top
R12  37.8,34.74 90 top
R13  37.13,32.79 90 top
R14  36.46,34.74 90 top
R15  35.79,32.79 90 top
R16  35.12,34.74 90 top
R17  34.46,32.79 90 top
R18  33.79,34.74 90 top
R19  54.11,7.28 0 top
R20  71.14,40.75 135 top
R21  24.52,49.83 0 top
R22  24.22,60.88 180 top
R23  26.12,35.48 90 top
R24  27.12,35.48 90 top
R25  25.12,35.48 270 top
R26  28.12,35.48 270 top
R27  67.22,43.58 0 top
R28  67.27,42.43 0 top
R29  28.07,40.53 180 top
R30  20.97,38.23 0 top
R31  20.37,41.13 180 top
R32  25.12,43.23 180 top
R33  28.22,65.58 180 top
R34  23.22,59.73 0 top
R35  34.07,57.98 90 top
R36  35.07,57.98 270 top
R37  30.92,54.23 180 top
R38  28.62,54.33 270 top
R39  27.52,54.33 270 top
R40  56.87,49.08 270 top
R41  57.87,49.08 90 top
R42  62.22,49.98 90 top
R43  62.22,48.08 90 top
R44  33.57,59.53 180 top
R45  53.52,65.83 270 top
SERIAL  73.07,44.69 318 top
SPK1  68.97,33.43 270 top
TAST_A  65.54,53.3 115 top
TAST_B  20,53.3 65 top
TAST_RESET  50.82,64.98 90 top
TP1  33.17,67.13 180 top
TP4  31.17,67.13 180 top
TP5  21.17,59.68 180 top
TP6  25.42,56.78 0 top
TP7  29.82,55.53 0 top
TP8  31.42,55.48 0 top
TP9  27.42,56.63 0 top
TP10  58.07,22.43 0 top
TP11  29.17,67.13 0 top
TP13  38.47,60.43 0 top
TP14  38.47,58.63 0 top
TP15  45.47,60.53 90 top
TP16  50.87,57.83 0 top
U1  24.2,40.53 270 top
U$1  [DS]  43.27,25.13 0 bottom
U$2  16.97,28.98 240 bottom
U$5  64.57,10.53 0 top
U$6  30.22,68.88 0 top
U$7  64.67,64.73 0 top
U$8  24.32,32.38 0 top
USB1  42.77,68.88 180 top

### Tracks (layer width: path | path; a pad name or v marks a point on that pad's centre or on a via)
+5V  (via drill 0.35)
  Top 0.2: R36.2 36.12,57.48 v36.37,57.78
  Top 0.254: TP15.TP 45.82,60.78
  Top 0.305: IC4.6 32.57,62.68 33.02,63.03 33.22,63.28 33.92,64.08 35.37,64.08 | v36.57,64.33 36.32,64.08 35.37,64.08 | 35.37,64.08 D4.C
  Top 0.406: C27.1 C28.1 45.47,59.18 | USB1.1 44.07,61.93 TP15.TP 45.47,59.18 | 45.47,59.18 44.92,59.18 42.82,57.08 37.07,57.08 v36.37,57.78
  Bottom 0.406: v36.37,57.78 35.62,58.53 35.62,63.33 v36.57,64.33
BMX_INT5
  Top 0.2: U1.10 20.97,41.03 R31.1
FL_CS  (via drill 0.35)
  Top 0.2: IC6.4 v57.33,56.69 v57.32,56.68 | v51.82,59.68 51.07,59.68 49.72,58.33 49.72,56.53 49.27,56.13 32.72,56.13 32.17,56.68 v32.17,57.43 | v26.17,60.08 26.17,60.33 26.52,60.68 IC4.23 | IC4.23
  Bottom 0.2: v57.32,56.68 54.32,59.68 v51.82,59.68 | v32.17,57.43 32.17,57.83 30.72,59.28 27.37,59.28 26.57,60.08 v26.17,60.08
FL_RESET  (via drill 0.35)
  Top 0.2: IC4.20 v26.17,62.18 | v26.17,62.18 | v56.07,56.68 56.07,57.82 IC6.3
  Bottom 0.2: v26.17,62.18 28.22,60.13 31.57,60.13 35.52,56.18 45.52,56.18 48.32,58.98 53.77,58.98 v56.07,56.68
FL_W  (via drill 0.35)
  Top 0.2: IC4.22 26.47,61.18 26.37,61.08 25.87,61.08 v25.62,60.83 | v58.47,63.83 IC6.5
  Bottom 0.2: v25.62,60.83 24.62,61.83 24.62,62.48 25.07,62.93 26.37,62.93 27.02,62.28 27.02,61.93 28.37,60.58 31.72,60.58 35.72,56.58 45.32,56.58 48.32,59.58 50.87,59.58 51.62,60.33 54.97,60.33 v58.47,63.83
GND  (via drill 0.35)
  Top 0.2: 19.92,31.98 19.46,31.98 U$2.GND 20.54,31.45 22.27,33.18 | IC1.34 27.59,28.63 v27.22,28.63 28.16,28.63 IC1.33 29.91,26.88 IC1.GND | U$2.GND@1 21.54,29.55 23.47,31.48
  Top 0.254: C5.2 35.42,61.78 35.52,61.88 | IC4.2 30.82,60.68 IC4.33 | Q2.2 C25.2
  Top 0.3: C19.2 26.57,23.28 v26.97,22.83 27.72,22.53
  Top 0.406: C22.2 22.47,61.83 Q3.2
  Bottom 0.406: EXP1.26 28.75,12.38 31.17,12.38
  other vias: 32.47,64.98 34.02,65.13 35.92,27.18 37.12,26.58 43.32,23.18 42.37,21.73 42.37,23.13 39.87,19.83 23.62,38.38 27.02,42.48 24.57,27.98 23.67,26.23 32.37,68.53 28.22,17.03 30.12,48.98 30.47,45.88 47.82,20.48 45.62,29.23 29.57,61.93 30.22,62.68 28.87,62.68 28.92,61.18 30.22,61.18 31.87,19.83 22.47,36.23 25.57,21.38 29.72,21.48 31.32,26.88 25.37,31.03 26.47,32.63 24.72,25.78 41.47,14.83 45.27,17.03 42.97,16.63 45.27,19.88 47.87,16.88 27.47,39.23 28.57,43.88 17.17,41.53 11.47,46.38 13.82,41.83 15.57,38.83 16.52,37.23 17.42,35.58 18.32,34.18 19.02,32.93 19.62,31.88 20.17,30.93 20.72,29.88 21.67,28.13 22.97,25.83 23.87,24.23 14.37,40.73 13.27,48.28 14.67,49.83 16.97,53.38 18.22,56.28 19.27,59.48 19.72,61.68 20.07,66.53 29.27,71.63 31.02,70.68 33.07,69.78 34.77,69.03 36.62,68.58 49.02,68.68 50.52,69.08 52.67,69.93 54.62,68.18 57.72,66.43 59.47,65.38 64.67,62.13 63.42,62.93 65.92,61.48 66.22,59.53 67.07,56.63 67.57,55.28 68.52,53.13 68.57,48.23 71.02,49.78 72.62,47.98 74.72,45.93 74.72,40.68 74.52,38.28 74.52,30.13 74.67,35.98 74.67,33.18 73.02,28.33 70.27,27.23 69.27,36.03 65.72,40.88 60.04,46.27 53.8,31.95 52.02,30.03 56.57,29.93 63.97,14.58 59.57,11.48 61.37,26.93 56.57,23.03 51.27,21.13 59.52,25.58 50.94,34.26 63.57,35.98 64.62,38.78 62.52,38.83 59.07,54.28 63.33,57.84 58.62,60.78 44.57,57.33 37.42,61.28 36.42,59.78 36.52,65.43 48.92,64.93 61.97,13.03 57.52,15.43 60.32,16.53 64.87,27.48 43.47,34.68 46.52,35.88 50.88,36.36 53.57,43.73 53.57,50.23 52.77,52.53 50.72,56.33 32.32,53.68 22.42,31.98 20.67,34.53 18.47,37.68 30.37,26.88 31.32,27.83 32.27,26.88 31.32,25.93 70.32,32.48 62.42,29.03 49.33,32.47 41.52,24.78 40.37,23.53 44.37,23.53 44.27,26.58 43.27,28.28 38.02,15.88 18.42,46.53 24.27,48.18 26.22,49.53 27.27,45.18 19.27,51.03 57.2,24.7 53.53,46.82 60.97,52.84 53.91,54.39 58.67,56.87 26.67,64.38 39.57,61.93 22.97,30.03 21.92,30.03 42.52,60.43 30.57,19.98 58.12,39.83 59.92,39.43 56.92,35.43 54.72,36.53 58.32,46.43 55.02,47.73 56.82,47.33 62.32,46.33 64.72,46.73 63.12,51.33 64.42,50.43 57.02,54.33 62.42,54.33 58.52,58.83 48.82,30.33 48.72,26.73 51.02,27.13 54.82,27.03 49.82,28.63 46.12,33.43 39.52,15.93 51.22,17.33 52.22,22.23 55.52,16.03 60.12,19.93 20.32,44.63 24.42,45.63 20.62,55.93 21.82,53.33 22.62,57.03 25.92,54.83 28.22,51.73 27.52,48.03 26.22,59.13 20.02,63.73 27.52,66.63 28.62,68.43 34.82,67.63 33.42,42.98 43.72,36.33 51.92,38.83 53.62,40.73 59.67,29.63 61.17,33.33 58.07,33.03 60.37,35.73 68.37,39.33 71.27,39.33 72.17,41.13 73.27,39.63 49.47,15.93 52.27,15.33 55.47,9.63 58.27,43.13 59.97,43.13 62.67,43.53 66.37,45.03 64.87,53.03 63.37,60.73 68.07,26.93 18.07,52.93 19.57,53.73 55.67,42.63
  pour Bottom: 34.37,5.48 8.07,51.28 19.47,65.78 18.47,72.78 23.07,76.28 27.07,76.28 32.87,70.48 52.47,70.38 66.37,61.48 75.07,46.18 74.87,29.08 66.57,15.58 51.37,5.68 34.67,4.98
  pour Top: 8.07,51.28 19.47,65.78 18.47,72.78 23.07,76.28 27.07,76.28 32.87,70.48 32.77,70.48 52.47,70.38 66.37,61.48 75.07,46.18 74.87,29.08 66.57,15.58 51.37,5.68 34.67,4.98
LED_C1  (via drill 0.35)
  Top 0.2: R1.2 42.77,35.78 LED21.A v43.87,37.48 | LED3.A 36.52,53.48 v37.07,52.93 | LED12.A 50.07,44.78 v50.07,44.58 44.07,44.58 v43.87,44.38
  Bottom 0.2: v37.07,52.93 49.32,52.93 50.07,52.18 v50.07,44.58 | v43.87,44.38 v43.87,37.48
LED_C2  (via drill 0.35)
  Top 0.2: LED4.A 41.47,52.18 38.47,52.18 v37.87,51.58 | v37.87,50.28 v37.87,47.58 | LED13.A 35.47,44.78 v37.87,44.78 38.07,44.58 v41.17,44.58 | R8.2 40.67,35.4 40.67,35.93 41.67,36.93 v41.67,37.68 42.27,38.28 44.47,38.28 46.07,36.68 49.97,36.68 LED22.A
  Bottom 0.2: v37.87,51.58 v37.87,50.28 | v37.87,47.58 v37.87,44.78 | v41.67,37.68 41.97,37.98 41.97,43.68 v41.17,44.58
LED_C3  (via drill 0.35)
  Top 0.2: LED5.A 49.37,53.48 48.67,54.18 45.87,54.18 44.02,52.33 v43.82,52.33 | v41.77,45.28 41.97,45.48 LED14.A | LED23.A 34.87,37.58 v35.67,37.58 | R9.2 39.87,33.45 39.87,35.93 v40.07,36.13
  Bottom 0.2: v43.82,52.33 41.77,50.28 v41.77,45.28 39.87,45.28 35.67,41.08 v35.67,37.58 35.67,37.48 35.17,36.98 35.17,36.38 35.57,35.98 39.92,35.98 v40.07,36.13
LED_C4  (via drill 0.35)
  Top 0.2: LED15.A 37.17,51.88 34.32,51.88 33.97,51.53 33.97,50.28 LED24.A 36.67,47.58 v37.07,47.58 | v37.07,43.98 39.77,43.98 39.97,43.78 v40.57,43.78 51.37,43.78 51.57,43.58 51.57,42.28 LED6.A | R10.2 39.13,35.99 39.17,36.08 39.97,36.88 v40.77,36.88
  Bottom 0.2: v37.07,47.58 v37.07,43.98 | v40.77,36.88 41.07,37.18 41.07,43.28 v40.57,43.78
LED_C5  (via drill 0.35)
  Top 0.2: v39.97,51.58 40.12,51.73 45.02,51.73 LED16.A 47.17,53.08 47.17,52.68 v48.27,51.58 | v39.97,50.28 39.57,50.28 LED25.A | v47.77,41.48 LED7.A 46.77,41.38 46.07,40.68 40.77,40.68 v40.47,40.98 | v47.77,46.98 48.27,47.48 v48.27,50.28 | R11.2 38.46,35.97 v40.47,37.98
  Bottom 0.2: v39.97,51.58 v39.97,50.28 | v47.77,41.48 v47.77,46.98 | v48.27,50.28 v48.27,51.58 | v40.47,37.98 v40.47,40.98
LED_C6  (via drill 0.35)
  Top 0.2: v48.67,40.98 48.67,41.68 48.17,42.18 v45.77,42.18 45.07,41.48 LED8.A 42.77,41.68 v39.87,41.68 | v48.67,37.48 LED17.A | v44.77,48.68 43.57,48.68 LED26.A | R12.2 37.8,36.21 v38.17,36.58
  Bottom 0.2: v48.67,40.98 v48.67,37.48 | v45.77,42.18 45.77,47.68 v44.77,48.68 | v38.17,36.58 39.67,38.08 39.67,41.48 v39.87,41.68
LED_C7  (via drill 0.35)
  Top 0.2: R13.2 37.13,36.44 37.67,36.98 v37.67,37.58 37.77,37.48 LED18.A | v37.67,40.38 LED9.A 39.57,42.28 v44.67,42.28 | v44.87,46.98 44.87,47.58 LED27.A
  Bottom 0.2: v37.67,40.38 v37.67,37.58 | v44.67,42.28 44.87,42.48 v44.87,46.98
LED_C8  (via drill 0.35)
  Top 0.2: R14.2 36.46,36.67 v36.97,37.18 | LED10.A 36.67,39.58 v36.97,39.58 38.07,39.58 38.77,40.28 51.07,40.28 51.97,41.18 51.97,43.88 v51.37,44.48 | v51.37,48.48 51.37,48.88 LED28.A
  Bottom 0.2: v36.97,37.18 v36.97,39.58 | v51.37,44.48 v51.37,48.48
LED_C9  (via drill 0.35)
  Top 0.2: LED29.A 44.52,45.48 43.77,46.23 41.77,46.23 41.02,45.48 LED11.A 36.27,45.48 35.47,46.28 34.17,46.28 33.97,46.08 33.97,44.88 34.77,44.08 35.27,44.08 v35.77,43.58 | v35.77,42.28 35.77,41.38 v36.37,40.78 | v35.77,36.68 35.79,36.5 R15.2
  Bottom 0.2: v35.77,43.58 v35.77,42.28 | v36.37,40.78 36.37,37.28 v35.77,36.68
LED_R1  (via drill 0.35)
  Top 0.2: LED5.C 50.07,55.68 43.47,55.68 LED4.C 42.07,55.68 35.47,55.68 LED3.C 33.47,53.68 33.47,48.48 33.97,47.98 | LED10.C LED9.C LED8.C LED7.C LED6.C | LED10.C 33.57,44.18 33.57,47.58 33.97,47.98 | 33.97,47.98 35.47,47.98 36.47,46.98 LED11.C | v33.37,38.78 33.37,41.58 LED10.C | v34.57,36.58 35.12,35.93 R16.2
  Bottom 0.2: v34.57,36.58 33.37,37.68 v33.37,38.78
LED_R2  (via drill 0.35)
  Top 0.2: LED15.C 39.47,54.28 43.77,54.28 44.27,54.78 46.57,54.78 | 46.57,54.78 LED16.C | LED13.C 35.77,46.98 36.47,46.28 40.92,46.28 41.62,46.98 LED14.C 43.87,46.98 44.57,46.28 50.07,46.28 LED12.C | 46.57,54.78 49.57,54.78 50.07,54.28 51.37,54.28 51.97,53.68 51.97,48.18 LED12.C | v33.97,39.88 35.17,39.88 36.07,38.98 LED18.C 39.47,39.68 46.07,39.68 LED17.C 47.67,39.78 51.17,39.78 52.37,40.98 52.37,45.38 LED12.C | v33.57,36.58 33.67,36.58 34.47,35.78 34.47,33.41 R17.2
  Bottom 0.2: v33.97,39.88 33.57,39.88 32.77,39.08 32.77,37.38 v33.57,36.58
LED_R3  (via drill 0.35)
  Top 0.2: LED24.C LED25.C LED26.C LED27.C 47.62,50.98 | 47.62,50.98 LED28.C 50.77,51.38 v51.37,51.98 | LED29.C 47.62,47.83 47.62,50.98 | v52.77,51.08 52.77,40.78 50.97,38.98 LED22.C 50.07,38.28 46.17,38.28 45.47,38.98 LED21.C 40.27,38.98 39.57,38.28 35.47,38.28 LED23.C 32.99,37.2 32.99,36.26 33.67,35.43 R18.2
  Bottom 0.2: v52.77,51.08 51.87,51.98 v51.37,51.98
MISO  (via drill 0.35)
  Top 0.2: IC4.32 R44.2 33.77,60.23 34.77,60.23 37.42,57.58 42.57,57.58 44.22,59.23 v44.22,59.88 | v49.47,60.63 47.77,60.63 v47.52,60.38 | v52.47,65.58 53.27,66.33 R45.1
  Bottom 0.2: v44.22,59.88 44.72,60.38 v47.52,60.38 | v49.47,60.63 52.47,63.68 v52.47,65.58
MISO_FL  (via drill 0.35)
  Top 0.2: R45.2 IC6.8 52.92,63.83 52.72,63.63 52.72,57.38 v51.97,56.63 | IC4.28 | IC4.28 29.32,57.78 v29.52,57.58
  Bottom 0.2: v29.52,57.58 29.52,57.28 31.82,54.98 46.12,54.98 48.62,57.48 49.57,57.48 49.72,57.33 49.72,56.23 50.27,55.68 51.02,55.68 v51.97,56.63
MOSI  (via drill 0.35)
  Top 0.2: IC4.31 30.82,58.83 31.07,58.58 31.07,58.03 v31.27,57.83 | v53.52,56.68 IC6.1
  Bottom 0.2: v31.27,57.83 31.17,57.83 30.52,57.18 30.52,56.88 32.02,55.38 45.92,55.38 48.72,58.18 52.02,58.18 v53.52,56.68
N$1  (via drill 0.35)
  Top 0.2: v44.42,22.53 46.87,24.98 v48.87,24.98 | v50.12,26.23 55.12,26.23 57.37,28.48 v57.37,31.58
  Top 0.254: v44.42,22.53 43.77,21.88 IC3.3 | v59.97,31.58 62.02,31.58 68.17,37.73 SPK1.1
  Bottom 0.2: v57.37,31.58 v59.97,31.58 | v48.87,24.98 v50.12,26.23
  Bottom 0.254: JP3.2 44.23,22.53 v44.42,22.53
N$2
  Top 0.16: IC1.38 27.62,25.73 26.67,25.73 25.97,25.03 25.97,23.03 27.22,21.78 28.17,21.78
  Top 0.2: C25.1 28.57,19.08 27.97,20.38 Q2.3 28,21.95 28.17,21.78
N$3
  Top 0.2: U1.19 R29.2
N$4
  Top 0.2: IC4.14 28.77,64.38 28.77,65.53 R33.1
N$5  (via drill 0.35)
  Top 0.2: LED2.C 24.32,58.43 v25.32,58.43 | v29.92,58.28 29.82,58.38 IC4.29 | IC4.29
  Bottom 0.2: v25.32,58.43 25.42,58.33 29.87,58.33 v29.92,58.28
N$6
  Top 0.2: U1.14 24.2,42.81 R32.2
N$7
  Top 0.254: Q1.1 R5.2
N$8
  Top 0.406: R34.1 22.72,58.43 LED2.A
N$9
  Top 0.406: P_+3V.1 F1.2
N$10  (via drill 0.35)
  Top 0.2: v44.52,21.63 46.77,23.88 46.77,24.18 46.97,24.38 v49.57,24.38 | v59.97,30.48 R4.1 | v50.72,25.53 55.27,25.53 58.02,28.28 v58.02,30.48
  Top 0.254: v44.52,21.63 44.27,21.38 IC3.2
  Bottom 0.2: v44.52,21.63 42.77,19.88 JP3.3 | v58.02,30.48 v59.97,30.48 | v49.57,24.38 v50.72,25.53
N$11
  Top 0.2: C22.1 21.52,63.18 23.12,63.18 24.07,62.23 Q3.3 24.42,62.53 24.52,62.53 25.17,63.18 IC4.18
N$12
  Top 0.254: R4.2 65.12,30.48 66.17,29.43 67.22,29.43 SPK1.2
N$13
  Top 0.16: Q2.1 27.57,20.38 26.97,21.53 25.62,22.88 25.62,25.18 26.57,26.13 27.46,26.13 IC1.37
  Top 0.2: C23.1 27.67,19.28
  Top 0.254: 27.67,19.28 Q2.1
N$14
  Top 0.15: L6.1 C14.1 28.52,30.03 28.77,29.76 IC1.30
N$15
  Top 0.15: C6.1 L4.1 27.52,29.28 28.22,29.13 IC1.32
N$16
  Top 0.15: L5.1 C6.2 C12.1
N$17
  Top 0.15: U$2.FEED 21.47,29.03 L5.2 C13.1
N$18
  Top 0.15: L4.2 L6.2 IC1.31
N$19
  Top 0.16: IC1.39 27.87,25.38 26.94,25.38 26.57,25.01 C19.1
N$20
  Top 0.2: C21.1 21.32,64.03 22.07,64.03 22.47,64.43 | 22.47,64.43 Q3.1 | 22.47,64.43 23.47,63.43 24.77,63.43 25.02,63.68 IC4.17
N$21
  Top 0.254: Q4.1 R21.2
N$24
  Top 0.2: C33.1 61.07,48.53 IC5.3 R43.2 R42.1
N$27  (via drill 0.35)
  Top 0.2: C11.1 R35.2 R36.1 | v32.32,58.53 32.37,58.48 C11.1 | IC4.19 26.72,62.68 26.57,62.68 26.47,62.78 25.82,62.78 v25.27,62.23 | C11.1 33.32,58.68 33.32,58.78 33.67,59.13 33.77,59.13 34.07,59.43 R44.1
  Bottom 0.2: v25.27,62.23 27.77,59.73 31.12,59.73 v32.32,58.53
N$29
  Top 0.2: R40.1 R41.2 59.72,49.58 IC5.4
N$30
  Top 0.2: C32.1 R40.2
N$31
  Top 0.2: MIC1.4 54.94,50.51 C32.2
P0  (via drill 0.35)
  Top 0.2: IC1.4 33.42,23.37 33.42,20.48 29.5,16.56 | 29.5,16.56 28.92,15.98 28.92,12.31 EXP1.24 | R6.1 12.22,38.64 v12.22,39.58 | v29.47,15.68 29.5,15.81 29.5,16.56
  Top 0.254: P_4.1 R6.1
  Bottom 0.2: v12.22,39.58 18.12,39.58 23.67,34.03 23.67,27.83 25.52,25.98 25.52,25.53 25.27,25.28 25.27,22.58 29.47,18.28 v29.47,15.68
P1
  Top 0.2: IC1.5 33.82,23.53 33.82,19.88 30.07,16.13 EXP1.23 30.07,12.83 31.17,11.73 31.17,8.85 R7.1
  Top 0.406: P_3.1 31.11,6.72 31.17,6.73 31.17,7.25 R7.1
P2
  Top 0.2: IC1.6 34.22,23.7 34.22,19.33 31.37,16.48 31.37,12.4 EXP1.22 33.94,9.78 52.27,9.78 53.57,8.48 53.57,7.38 53.77,7.33 53.78,7.33 R19.1 53.61,6.94 53.87,6.68 56.92,6.68 P_2.1
P3  (via drill 0.35)
  Top 0.2: IC1.7 34.82,23.66 v34.82,23.28 | R41.1 IC5.1 C34.1 59.12,39.38 47.02,27.28 v43.42,27.28
  Bottom 0.2: v34.82,23.28 34.82,22.58 35.17,22.23 37.97,22.23 43.02,27.28 v43.42,27.28
P4  (via drill 0.35)
  Top 0.2: EXP1.20 33.92,12.39 33.92,17.08 35.02,18.18 35.02,19.78 36.12,20.88 36.12,22.28 v35.52,22.88 35.52,23.53 35.42,23.63 35.02,24.03 IC1.8 | R1.1 42.24,27.97 v42.42,27.78
  Bottom 0.2: v42.42,27.78 42.42,27.28 38.02,22.88 36.62,22.88 36.37,22.63 35.77,22.63 v35.52,22.88
P5  (via drill 0.35)
  Top 0.2: EXP1.19 35.15,17.46 35.42,17.73 35.42,19.58 36.57,20.73 36.57,22.88 v36.17,23.33 36.17,23.45 IC1.9 | R8.1 v40.62,31.13
  Bottom 0.2: v40.62,31.13 40.62,28.58 41.42,27.78 41.42,26.83 37.92,23.33 v36.17,23.33
P6  (via drill 0.35)
  Top 0.2: EXP1.18 36.42,12.43 36.42,14.13 35.82,14.73 35.82,19.43 36.97,20.58 36.97,23.68 v36.75,23.91 36.34,24.31 35.87,24.31 IC1.10 | R9.1 39.95,26.96 v39.17,26.18
  Bottom 0.2: v39.17,26.18 37.07,24.23 v36.75,23.91
P7  (via drill 0.35)
  Top 0.2: EXP1.17 36.22,15.17 36.22,19.28 37.37,20.43 37.37,24.28 v36.72,24.93 35.82,24.93 IC1.11 | R10.1 39.13,27.09 v39.17,27.08
  Bottom 0.2: v39.17,27.08 38.97,26.88 v36.72,24.93
P8
  Top 0.15: 35.07,28.08 36.69,29.71 | 36.69,29.71 37.32,30.33 37.62,30.33 38.47,31.18 38.47,31.43 38.46,31.48 | 37.77,27.83 37.77,27.98 36.44,29.31 36.44,29.46 36.69,29.71
  Top 0.2: EXP1.16 38.97,12.42 38.97,13.93 36.62,16.28 36.62,19.03 37.77,20.18 37.77,27.83 | 35.07,28.08 IC1.14 | 38.46,31.48 R11.1
P9  (via drill 0.35)
  Top 0.15: IC1.15 37.07,30.68 37.37,30.68 37.8,31.11 v37.8,31.73
  Top 0.2: EXP1.15 38.77,15.16 38.77,19.03 38.17,19.63 38.17,28.13 37.82,28.48 37.82,29.08 v38.17,29.43 | 37.8,31.43 v37.8,31.73 R12.1
  Bottom 0.15: v38.17,29.43 38.17,31.3 v37.8,31.73
P10  (via drill 0.35)
  Top 0.15: IC1.16 37.13,31.27 37.13,31.28
  Top 0.2: EXP1.12 44.02,12.45 44.02,13.98 41.52,16.48 40.12,16.48 39.17,17.43 39.17,19.23 38.57,19.83 38.57,28.58 v38.47,28.68 | v37.13,31.32 37.13,31.28 | R13.1 37.13,31.27
  Bottom 0.2: v38.47,28.68 37.82,28.68 37.13,29.37 37.13,31.28 v37.13,31.32
P11  (via drill 0.35)
  Top 0.15: IC1.17 36.46,31.17
  Top 0.2: 36.46,31.17 v36.46,31.73 R14.1
  Bottom 0.2: EXP1.11 43.82,15.19 43.82,20.08 45.12,21.38 45.12,27.53 40.32,32.33 37.06,32.33 v36.46,31.73
P12  (via drill 0.35)
  Top 0.15: IC1.18 35.79,31.07
  Top 0.2: 35.79,31.07 v35.79,31.33 R15.1
  Bottom 0.2: EXP1.10 46.32,12.69 46.32,14.13 44.22,16.23 44.22,19.93 45.57,21.28 45.57,27.63 40.47,32.73 36.47,32.73 36.07,32.33 36.08,32.33 35.79,32 v35.79,31.33
P13  (via drill 0.35)
  Top 0.15: IC1.19 35.12,30.97
  Top 0.2: 35.12,30.97 v35.12,31.73 R16.1
  Bottom 0.2: EXP1.9 46.37,15.23 46.37,19.08 45.97,19.43 45.97,27.78 40.62,33.13 36.32,33.13 35.92,32.73 35.12,31.83 v35.12,31.73
P14  (via drill 0.35)
  Top 0.15: IC1.20 34.46,30.86
  Top 0.2: 34.46,30.86 v34.46,31.18 R17.1
  Bottom 0.2: EXP1.8 48.82,12.73 48.82,14.23 46.77,16.28 46.77,19.23 46.37,19.63 46.37,29.68 44.47,31.58 42.77,31.58 40.82,33.53 35.69,33.53 R17.1 v34.46,31.18
P15  (via drill 0.35)
  Top 0.15: IC1.21 33.79,30.76
  Top 0.2: 33.79,30.76 v33.79,31.68 R18.1
  Bottom 0.2: EXP1.7 50.39,20.01 46.77,23.63 46.77,29.83 44.67,31.98 42.97,31.98 41.07,33.93 35.52,33.93 33.79,32.2 v33.79,31.68
P16  (via drill 0.35)
  Top 0.15: v65.87,43.58 R27.1 | v33.17,32.18 33.17,30.71 IC1.22
  Top 0.2: EXP1.6 53.92,12.15 53.92,14.13 53.37,14.68 53.37,16.48 49.32,20.53 v49.32,21.98
  Bottom 0.15: EXP1.6 55.21,8.88 57.07,8.88 62.07,11.88 64.97,14.38 68.77,24.48 71.17,26.88 71.17,37.88 67.27,41.78 65.37,41.78 65.37,43.08 v65.87,43.58
  Bottom 0.2: v49.32,21.98 47.17,24.13 47.17,30.03 44.82,32.38 43.17,32.38 41.22,34.33 35.37,34.33 33.22,32.18 v33.17,32.18
P17  (via drill 0.35)
  Top 0.15: IC1.25 30.52,30.79 31.67,31.94 31.67,42.21 R3.1
  Top 0.2: R3.1 22.18,46.89 TAST_B.3 23.32,51.7 v23.32,51.73 | v24.92,55.13 TAST_B.4
  Bottom 0.2: v23.32,51.73 24.92,53.33 v24.92,55.13
P18  (via drill 0.35)
  Top 0.15: v31.07,33.18 31.07,31.98 30.07,30.98 30.07,30.68 IC1.26
  Top 0.2: LED1.1 41.37,30.06 41.37,30.03 41.42,30.08 v41.42,34.93
  Bottom 0.2: v41.42,34.93 41.22,34.73 35.22,34.73 33.67,33.18 v31.07,33.18
P19
  Top 0.15: IC1.27 29.72,30.46 29.72,31.83 27.12,34.43 R24.1
P20
  Top 0.15: IC1.28 29.37,30.25 29.37,31.68 26.12,34.93 R23.1
P21  (via drill 0.35)
  Top 0.15: v65.97,42.38 66.02,42.43 R28.1 | v27.37,24.78 27.82,24.78 27.82,24.8 IC1.40
  Bottom 0.15: EXP1.5 51.97,12.74 51.97,10.68 | 51.97,10.68 54.17,8.48 57.17,8.48 62.27,11.58 65.27,14.18 69.07,24.18 71.67,26.68 71.67,37.98 67.27,42.38 v65.97,42.38 | 51.97,10.68 51.47,10.18 36.97,10.18 36.37,10.78 36.37,11.38 35.47,12.28 34.67,12.28 33.67,13.28 33.67,14.08 29.92,17.88 29.92,18.38 28.22,20.08 25.72,22.68 25.72,24.33 26.22,24.78 v27.37,24.78 27.67,24.78
P22  (via drill 0.35)
  Top 0.16: IC1.41 28.02,24.43 27.87,24.43 v27.37,23.93
  Top 0.2: P_1.1 74.92,39.13 73.65,40.4 R20.1 72.19,39.7 v72.22,39.68 | v32.92,16.78 32.61,16.47 EXP1.21
  Bottom 0.16: v27.37,23.93 27.57,23.73 27.57,22.03
  Bottom 0.2: v72.22,39.68 72.22,26.73 69.42,23.93 65.62,13.98 62.47,11.18 57.27,8.08 53.97,8.08 52.27,9.78 34.77,9.78 33.87,10.68 33.87,12.44 EXP1.21 | 27.57,22.03 v32.92,16.78
P24  (via drill 0.35)
  Top 0.15: IC1.43 28.6,23.88 v28.17,23.88
  Top 0.2: v30.72,50.23 30.72,50.43 27.52,53.63 R39.2
  Bottom 0.2: v28.17,23.88 28.37,24.08 28.37,28.38 26.97,29.78 26.97,31.58 29.27,33.88 29.27,35.98 31.12,37.83 31.12,49.83 v30.72,50.23
P25  (via drill 0.35)
  Top 0.15: IC1.44 28.37,23.08 v28.22,23.08
  Top 0.2: v31.07,50.98 28.62,53.43 R38.2
  Bottom 0.16: v28.22,23.08 28.37,23.08 28.77,23.48 28.77,28.53
  Bottom 0.2: 28.77,28.53 27.37,29.93 27.37,31.38 29.67,33.68 29.67,35.83 31.52,37.68 31.52,50.53 v31.07,50.98
P26  (via drill 0.35)
  Top 0.15: IC1.45 28.97,23.12 v28.97,22.88
  Top 0.254: R2.1 64.76,45.42 67.32,47.98 67.32,48.68 TAST_A.3 68.82,50.63 65.89,53.56 TAST_A.4 64.04,56.03 v63.77,56.03 | v52.27,55.38 52.92,56.03 v59.37,56.03
  Bottom 0.2: v52.27,55.38 50.77,53.88 33.77,53.88 31.92,52.03 31.92,37.53 30.07,35.68 30.07,33.53 27.77,31.23 27.77,30.08 29.17,28.68 29.17,23.18 v28.97,22.88
  Bottom 0.254: v59.37,56.03 v63.77,56.03
P27  (via drill 0.35)
  Top 0.15: IC1.46 29.57,23.15 v29.57,22.38
  Top 0.2: v25.62,44.33 R32.1 27.87,43.23 28.57,42.53 R29.1 28.57,39.48 v28.62,39.43 | v18.87,41.13 R31.2 | v31.07,35.78 31.07,37.78 v30.52,38.33
  Top 0.254: R30.1 19.87,38.83 R31.2
  Bottom 0.2: v25.62,44.33 22.07,44.33 v18.87,41.13 | v29.57,22.38 29.57,28.88 28.17,30.28 28.17,31.08 30.47,33.38 30.47,35.18 v31.07,35.78 | v30.52,38.33 29.32,39.43 v28.62,39.43
P28  (via drill 0.35)
  Top 0.15: v30.57,21.38 30.57,21.43 30.12,21.88 30.12,23.14 IC1.47
  Top 0.2: IC3.7 v39.47,21.38
  Bottom 0.2: v39.47,21.38 39.12,21.03 31.57,21.03 31.22,21.38 v30.57,21.38
P29  (via drill 0.35)
  Top 0.15: v30.72,22.18 30.52,22.38 30.52,22.97 IC1.48
  Top 0.2: IC3.6 40.22,21.88 v40.02,22.08
  Bottom 0.2: v40.02,22.08 39.32,22.08 38.67,21.43 31.77,21.43 31.12,22.08 30.82,22.08 v30.72,22.18
P30  (via drill 0.35)
  Top 0.2: IC3.5 40.67,22.38 40.27,22.78 v39.47,22.78 | v32.82,22.78 32.82,23.4 IC1.3
  Bottom 0.2: v39.47,22.78 39.37,22.78 38.42,21.83 33.72,21.83 32.82,22.73 v32.82,22.78
RESET_SW  (via drill 0.35)
  Top 0.2: IC4.21 26.47,61.68 26.37,61.58 25.67,61.58 25.42,61.58 R22.1 24.67,60.83 v24.67,60.13 | TAST_RESET.4 TAST_RESET.3 51.9,61.66 C20.1 51.72,61.31 51.55,61.11 49.17,58.73 49.17,56.98 v49.07,56.88
  Bottom 0.254: 46.72,54.53 27.52,54.53 24.02,58.03 24.02,59.48 v24.67,60.13
  Bottom 0.305: v49.07,56.88 46.72,54.53
RX
  Top 0.254: R27.2 SERIAL.1
SCK  (via drill 0.35)
  Top 0.2: IC4.30 30.32,58.73 30.52,58.53 30.52,57.73 v31.22,57.03 | v54.77,56.68 54.79,56.65 IC6.2
  Bottom 0.2: v31.22,57.03 32.47,55.78 45.72,55.78 48.52,58.58 53.57,58.58 54.77,57.38 v54.77,56.68
SCL/P19  (via drill 0.35)
  Top 0.2: R26.1 R24.2 v27.12,36.83 | EXP1.3 54.82,14.35 54.82,14.83 54.32,15.33 54.32,16.83 50.52,20.63 v50.52,21.98 | v31.07,34.88 29.82,36.13 29.82,37.33 v30.07,37.63
  Top 0.254: v20.97,40.08 21.42,40.53 U1.9
  Bottom 0.2: v20.97,40.08 20.97,39.23 23.42,36.83 v27.12,36.83 27.92,37.63 v30.07,37.63 | v50.52,21.98 50.52,22.28 47.97,24.83 47.97,30.33 45.12,33.18 43.47,33.18 42.42,34.23 42.42,35.33 41.82,35.93 40.97,35.93 40.57,35.53 31.72,35.53 v31.07,34.88
  Bottom 0.254: I2C.1 12.84,40.08 v20.97,40.08
SDA/P20  (via drill 0.35)
  Top 0.2: R23.2 R25.1 v25.12,37.43 | EXP1.4 54.37,12.26 54.37,14.38 53.87,14.88 53.87,16.68 49.92,20.63 v49.92,21.33 | v31.07,34.03 29.42,35.68 29.42,37.98 v29.62,38.28
  Top 0.254: I2C.2 13.17,42.58 v21.72,42.58 22.32,42.58 22.7,42.2 U1.11
  Bottom 0.2: v21.72,42.58 21.72,39.18 23.17,37.73 24.82,37.73 v25.12,37.43 25.92,38.28 v29.62,38.28 | v49.92,21.33 49.92,22.28 47.57,24.63 47.57,30.18 44.97,32.78 43.32,32.78 42.02,34.08 42.02,35.18 41.67,35.53 41.17,35.53 40.77,35.13 32.17,35.13 v31.07,34.03
SWCLK
  Top 0.2: IC4.10 30.82,65.23 31.27,65.68 31.72,65.68 TP1.TP
SWDCLK
  Top 0.2: IC4.26 28.32,57.28 TP7.TP 29.37,54.48 29.37,53.53 32.12,50.78 32.12,30.79 IC1.24
SWDIO
  Top 0.2: IC4.13 29.32,65.28 TP4.TP
SWDIO/RESET
  Top 0.2: IC4.27 28.82,57.43 29.32,56.98 30.32,56.98 TP8.TP R37.1 31.42,52.43 32.57,51.28 32.57,30.68 IC1.23
TO_P24
  Top 0.2: IC4.24 27.12,60.13 27.12,58.48 TP6.TP 27.37,54.93 27.37,54.78 R39.1
TO_P25
  Top 0.2: IC4.25 27.82,58.18 27.42,57.78 TP9.TP 28.57,55.48 28.57,54.93 R38.1
TX
  Top 0.254: R28.2 69.4,42.43 SERIAL.2
USB_DM  (via drill 0.35)
  Top 0.16: IC4.4 32.42,61.68 32.92,61.18 v36.37,61.18 | USB1.2 43.42,59.13 42.27,57.98 40.22,57.98 40.02,58.18 IC2.1 TP14.TP | 37.92,58.63 v37.22,59.33
  Top 0.254: TP14.TP 37.92,58.63
  Bottom 0.16: v37.22,59.33 37.22,60.33 v36.37,61.18
USB_DP
  Top 0.15: IC4.3
  Top 0.16: IC4.3 32.42,61.18 32.77,60.83 35.87,60.83 36.32,60.38 38.42,60.38 TP13.TP IC2.6 | USB1.3 42.77,61.63 42.42,61.28 40.42,61.28 40.07,60.93 40.07,60.48
  Top 0.254: 40.07,60.48 IC2.6
USB_VREG  (via drill 0.35)
  Top 0.2: IC4.15 28.32,65.03 R33.2 | 56.06,65.25 C37.1
  Top 0.254: IC4.7 32.42,63.18 32.62,63.38 v32.97,64.03
  Top 0.305: IC4.5 | IC4.5 v33.02,62.18 | IC6.6 56.06,65.25 | C37.1 56.52,65.98 C38.1
  Top 0.406: R34.2 R22.2 23.37,60.88 | 33.72,62.18 C5.1 33.72,62.58 C4.1 | v26.87,65.53 26.92,65.58 R33.2 | 33.72,62.18 | 33.72,62.18 v33.02,62.18 | C37.1 v56.77,65.38
  Top 0.6: TP5.TP 22.27,60.88 v22.92,60.88 23.37,60.88
  Top 0.61: Q4.3 23.42,53.48 21.62,55.28 21.62,59.23 TP5.TP
  Bottom 0.305: 33.02,63.98 v32.97,64.03
  Bottom 0.406: 33.02,63.98 v33.02,62.18 33.02,59.98 36.07,57.08 40.27,57.08 44.22,61.08 48.52,61.08 50.42,62.98 50.42,66.03 51.67,67.28 54.87,67.28 v56.77,65.38 | v32.97,64.03 32.17,64.03 30.67,65.53 v26.87,65.53
  Bottom 0.6: v22.92,60.88 22.92,63.43 v26.87,65.53
VCC  (via drill 0.35)
  Top 0.15: IC1.29 29.02,30.03 28.87,31.08 28.47,31.48 C10.1
  Top 0.2: IC1.1 32.12,22.97 32.12,22.33 C7.1 | IC1.12 35.68,25.64 C8.1 | IC1.35 27.67,27.98 C9.1 27.11,27.98 IC1.36 | R7.2 30.12,7.33 28.77,8.68 28.77,11.63 28.26,12.14 28.26,12.97 EXP1.25 | EXP1.2 54.58,7.73 R19.2 | U1.7 22.7,38.41 C24.1 | R20.2 70.71,41.13 | R37.2 v30.42,53.38 | v29.22,50.28 29.22,48.03 C30.1 | IC1.29 29.02,30.03 v28.82,30.68
  Top 0.254: R6.2 13.14,39.81 12.57,40.38 10.27,40.38 8.97,41.68 8.97,43.63 10.77,45.43 13.14,45.43 I2C.3 | IC3.8 41.4,20.81 v40.82,20.23 | 42.27,24.38 C1.1 | R30.2 22.42,38.23 C24.1 22.92,37.73 24.22,37.73 | U1.3 24.7,38.21 24.22,37.73 | U1.13 23.7,42.5 C2.1 | C7.1 31.67,21.88 31.47,21.88 31.22,21.63 31.22,20.88 31.17,20.83 v31.17,20.53 31.17,20.23 31.22,20.18 31.22,18.93 27.53,15.24 EXP1.25 | v25.12,34.23 R25.2 24.57,34.98 24.27,35.28 24.27,37.68 24.22,37.73 | v28.12,34.23 R26.2 | C8.1 36.26,25.88 v36.87,28.03 | R3.2 27.99,46.88 29.17,46.88 | MIC1.1 54.94,54.28 C35.1
  Top 0.3: C9.1 26.22,27.68 C15.1 v27.02,26.93
  Top 0.305: R3.2 28.07,46.98 C29.1 | C36.1 IC5.5
  Top 0.406: EXP1.2 56.72,12.45 56.72,16.63 Q1.2 | 51,23.47 D3.A 50.91,24.29 49.47,25.73 43.62,25.73 42.27,24.38 v41.52,23.63 | v22.22,43.48 22.72,43.48 C2.1 | SERIAL.3 70.92,41.13 70.71,41.13 C18.1 67.82,41.08 67.82,40.18 67.37,39.73 63.86,39.73 63.76,39.63 | C1.1 41.02,27.68 LED1.2 40.67,27.76 v40.67,26.98 | C3.+ 58.82,27.83 58.82,32.53 63.76,37.47 63.76,39.63 | 63.76,39.63 R2.2 63.76,49.7 62.97,50.48 R42.2 62.22,51.58 61.77,52.03 60.17,52.03 | v28.12,34.23 28.87,34.23 28.92,34.28 | 28.92,34.28 28.92,38.68 29.62,39.38 | v30.42,32.23 30.42,32.78 28.92,34.28 | C36.1 60.17,52.03 | 60.17,52.03 60.17,54.33 | 60.17,54.33 59.37,55.13 55.22,55.13 54.97,54.88 C35.1 | F1.1 60.97,58.38 C31.1 60.42,54.58 60.17,54.33
  Top 0.6: C29.1 C30.1 | 29.17,46.88 v29.17,45.93
  Top 0.61: C3.+ 53.87,23.46 | 53.87,23.46 51,23.47 | I2C.3 13.89,44.68 C17.1 17.97,44.13 18.62,43.48 v22.22,43.48 | 29.62,39.38 v29.62,43.18 | Q4.2 27.72,50.48 v27.72,49.48 | Q1.2 54.82,18.03 53.87,18.98 53.87,23.46
  Bottom 0.2: v30.42,53.38 29.22,52.18 v29.22,50.28 | v27.02,26.93 26.47,27.48 26.47,31.78 25.12,33.13 v25.12,34.23
  Bottom 0.254: v25.12,34.23 v28.12,34.23
  Bottom 0.3: 31.07,20.63 v31.17,20.53
  Bottom 0.406: v41.52,23.63 41.52,20.93 v40.82,20.23 40.52,20.53 31.27,20.53 | 31.27,20.53 31.12,20.58 v31.17,20.53 31.27,20.53 | v30.42,32.23 30.42,32.18 v28.82,30.68
  Bottom 0.61: v29.17,45.93 26.72,43.48 v22.22,43.48 | v29.62,43.18 29.62,45.48 v29.17,45.93 | 30.42,32.18 31.77,32.18 35.92,28.03 v36.87,28.03 37.07,27.83 39.77,27.88 v40.67,26.98 | v27.72,49.48 29.17,48.03 v29.17,45.93
VIN
  Top 0.61: BAT.1 58.82,23.68 TP10.TP 58.07,19.53 Q1.3
VM
  Top 0.254: IC3.1 45.82,20.88 C16.1 | C26.1 45.82,21.58 C16.1 | C16.1 45.92,20.48
  Top 0.305: 45.92,20.48 45.92,20.18 47.57,18.53
  Top 0.406: 47.57,18.53 JP3.5 | C26.1 45.92,22.03 46.97,23.08 47.33,23.08 D3.C

### Text on the board
tPlace: rev | 0.3
tDocu: +